# EAGLE design BMSv5 (EAGLE 7.2.0)

## Sheet 1 of 6
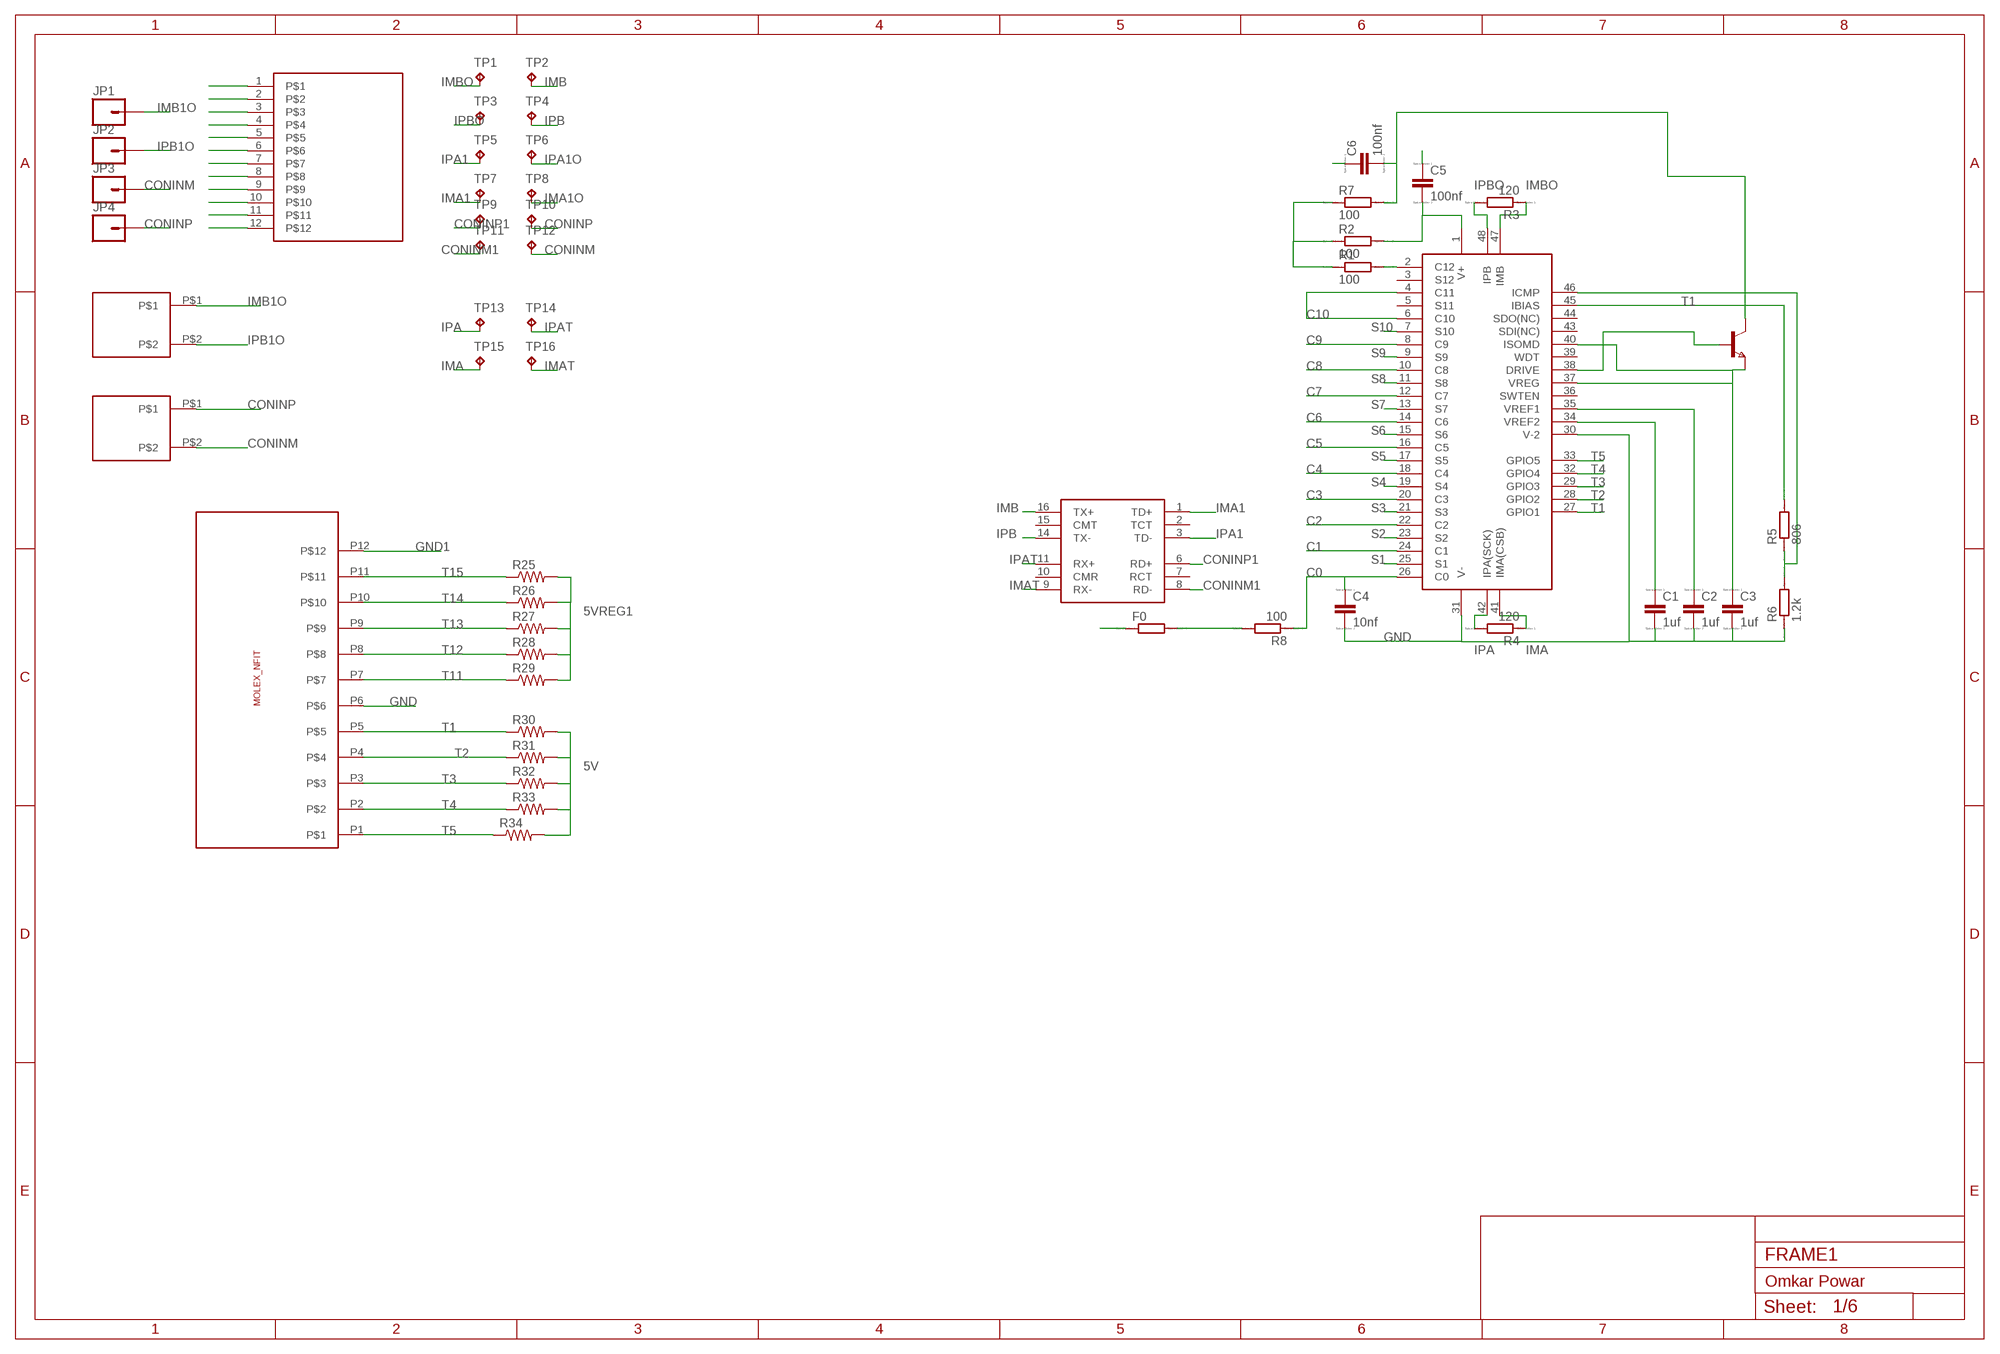
[diagram p0: schematic, sheet 1]

### Parts
C1  1uf  CC1206  [C1206]
C2  1uf  CC1206  [C1206]
C3  1uf  CC1206  [C1206]
C4  10nf  CC1206  [C1206]
C5  100nf  CC1206  [C1206]
C6  100nf  CC1206  [C1206]
F0  RR0603  [R0603]
JP1  M01PTH  [1X01]
JP2  M01PTH  [1X01]
JP3  M01PTH  [1X01]
JP4  M01PTH  [1X01]
R1  100  RR1206  [R1206]
R2  100  RR1206  [R1206]
R3  120  RR1206  [R1206]
R4  120  RR1206  [R1206]
R5  806  RR1206  [R1206]
R6  1.2k  RR1206  [R1206]
R7  100  RR1206  [R1206]
R8  100  RR1206  [R1206]
R25  R-US_R1206  [R1206]
R26  R-US_R1206  [R1206]
R27  R-US_R1206  [R1206]
R28  R-US_R1206  [R1206]
R29  R-US_R1206  [R1206]
R30  R-US_R1206  [R1206]
R31  R-US_R1206  [R1206]
R32  R-US_R1206  [R1206]
R33  R-US_R1206  [R1206]
R34  R-US_R1206  [R1206]
T1  NPNSOT223  [SOT223]
TP1  TPTP08SQ  [TP08SQ]
TP2  TPTP08SQ  [TP08SQ]
TP3  TPTP08SQ  [TP08SQ]
TP4  TPTP08SQ  [TP08SQ]
TP5  TPTP08SQ  [TP08SQ]
TP6  TPTP08SQ  [TP08SQ]
TP7  TPTP08SQ  [TP08SQ]
TP8  TPTP08SQ  [TP08SQ]
TP9  TPTP08SQ  [TP08SQ]
TP10  TPTP08SQ  [TP08SQ]
TP11  TPTP08SQ  [TP08SQ]
TP12  TPTP08SQ  [TP08SQ]
TP13  TPTP08SQ  [TP08SQ]
TP14  TPTP08SQ  [TP08SQ]
TP15  TPTP08SQ  [TP08SQ]
TP16  TPTP08SQ  [TP08SQ]
U$1  LTC6804  [SSOP-48_FW]
U$2  HX1188N  [HX1188]
U$3  TE12PIN  [TE12PIN]
U$4  MOLEX_2_PIN  [MOLEX_2PIN]
U$6  MOLEX_2_PIN  [MOLEX_2PIN]
U$8  MOLEX_12_PIN  [MOLEX_12PIN]

### Nets
5V: C3.1 R30.2 R31.2 R32.2 R33.2 R34.2 T1.3(E) U$1.37(VREG) U$1.40(ISOMD)
5VREG1: R25.2 R26.2 R27.2 R28.2 R29.2 ; also sheet 2
AFTFUSE: R1.1 R2.1 R7.1 ; also sheet 3
B1: U$3.2 ; also sheet 4
B2: U$3.3 ; also sheet 4
B3: U$3.4 ; also sheet 4
B4: U$3.5 ; also sheet 4
B5: U$3.6 ; also sheet 4
B6: U$3.7 ; also sheet 3
B7: U$3.8 ; also sheet 3
B8: U$3.9 ; also sheet 3
B9: U$3.10 ; also sheet 3
B10: U$3.11 ; also sheet 3
C0: C4.1 R8.1 U$1.26(C0)
C1: U$1.24(C1) ; also sheet 4
C2: U$1.22(C2) ; also sheet 4
C3: U$1.20(C3) ; also sheet 4
C4: U$1.18(C4) ; also sheet 4
C5: U$1.16(C5) ; also sheet 4
C6: U$1.14(C6) ; also sheet 3
C7: U$1.12(C7) ; also sheet 3
C8: U$1.10(C8) ; also sheet 3
C9: U$1.8(C9) ; also sheet 3
C10: U$1.4(C11) U$1.6(C10) ; also sheet 3
CELL0V: F0.1 U$3.1
CONINM: JP3.1 TP12.TP U$6.P$2
CONINM1: TP11.TP U$2.8(RD-)
CONINP: JP4.1 TP10.TP U$6.P$1
CONINP1: TP9.TP U$2.6(RD+)
GND: C1.2 C2.2 C3.2 C4.2 C5.1 C6.1 F0.2 R6.1 R8.2 U$1.30(V-2) U$1.31(V-) U$8.P6 ; also sheet 4
GND1: U$8.P12 ; also sheet 2,6
IMA: R4.1 TP15.TP U$1.41(IMA(CSB))
IMA1: TP7.TP U$2.1(TD+)
IMA1O: TP8.TP ; also sheet 2
IMAT: TP16.TP U$2.9(RX-)
IMB: TP2.TP U$2.16(TX+)
IMB1O: JP1.1 U$4.P$1 ; also sheet 2
IMBO: R3.1 TP1.TP U$1.47(IMB)
IPA: R4.2 TP13.TP U$1.42(IPA(SCK))
IPA1: TP5.TP U$2.3(TD-)
IPA1O: TP6.TP ; also sheet 2
IPAT: TP14.TP U$2.11(RX+)
IPB: TP4.TP U$2.14(TX-)
IPB1O: JP2.1 U$4.P$2 ; also sheet 2
IPBO: R3.2 TP3.TP U$1.48(IPB)
N$1: C6.2 R7.2 T1.2(C) T1.4(C)
N$11: C5.2 R2.2 U$1.1(V+)
N$12: T1.1(B) U$1.38(DRIVE)
N$16: C1.1 U$1.34(VREF2)
N$17: C2.1 U$1.35(VREF1)
N$19: R5.1 R6.2 U$1.46(ICMP)
N$21: R1.2 U$1.2(C12)
N$22: R5.2 U$1.45(IBIAS)
N$67: U$3.12
S1: U$1.25(S1)
S2: U$1.23(S2)
S3: U$1.21(S3)
S4: U$1.19(S4)
S5: U$1.17(S5)
S6: U$1.15(S6)
S7: U$1.13(S7)
S8: U$1.11(S8)
S9: U$1.9(S9)
S10: U$1.7(S10)
T1: R30.1 U$1.27(GPIO1) U$8.P5
T2: R31.1 U$1.28(GPIO2) U$8.P4
T3: R32.1 U$1.29(GPIO3) U$8.P3
T4: R33.1 U$1.32(GPIO4) U$8.P2
T5: R34.1 U$1.33(GPIO5) U$8.P1
T11: R29.1 U$8.P7 ; also sheet 2
T12: R28.1 U$8.P8 ; also sheet 2
T13: R27.1 U$8.P9 ; also sheet 2
T14: R26.1 U$8.P10 ; also sheet 2
T15: R25.1 U$8.P11 ; also sheet 2
Unconnected: U$1.3(S12) U$1.5(S11) U$1.36(SWTEN) U$1.39(WDT) U$1.43(SDI(NC)) U$1.44(SDO(NC)) U$2.2(TCT) U$2.7(RCT) U$2.10(CMR) U$2.15(CMT)

## Sheet 2 of 6
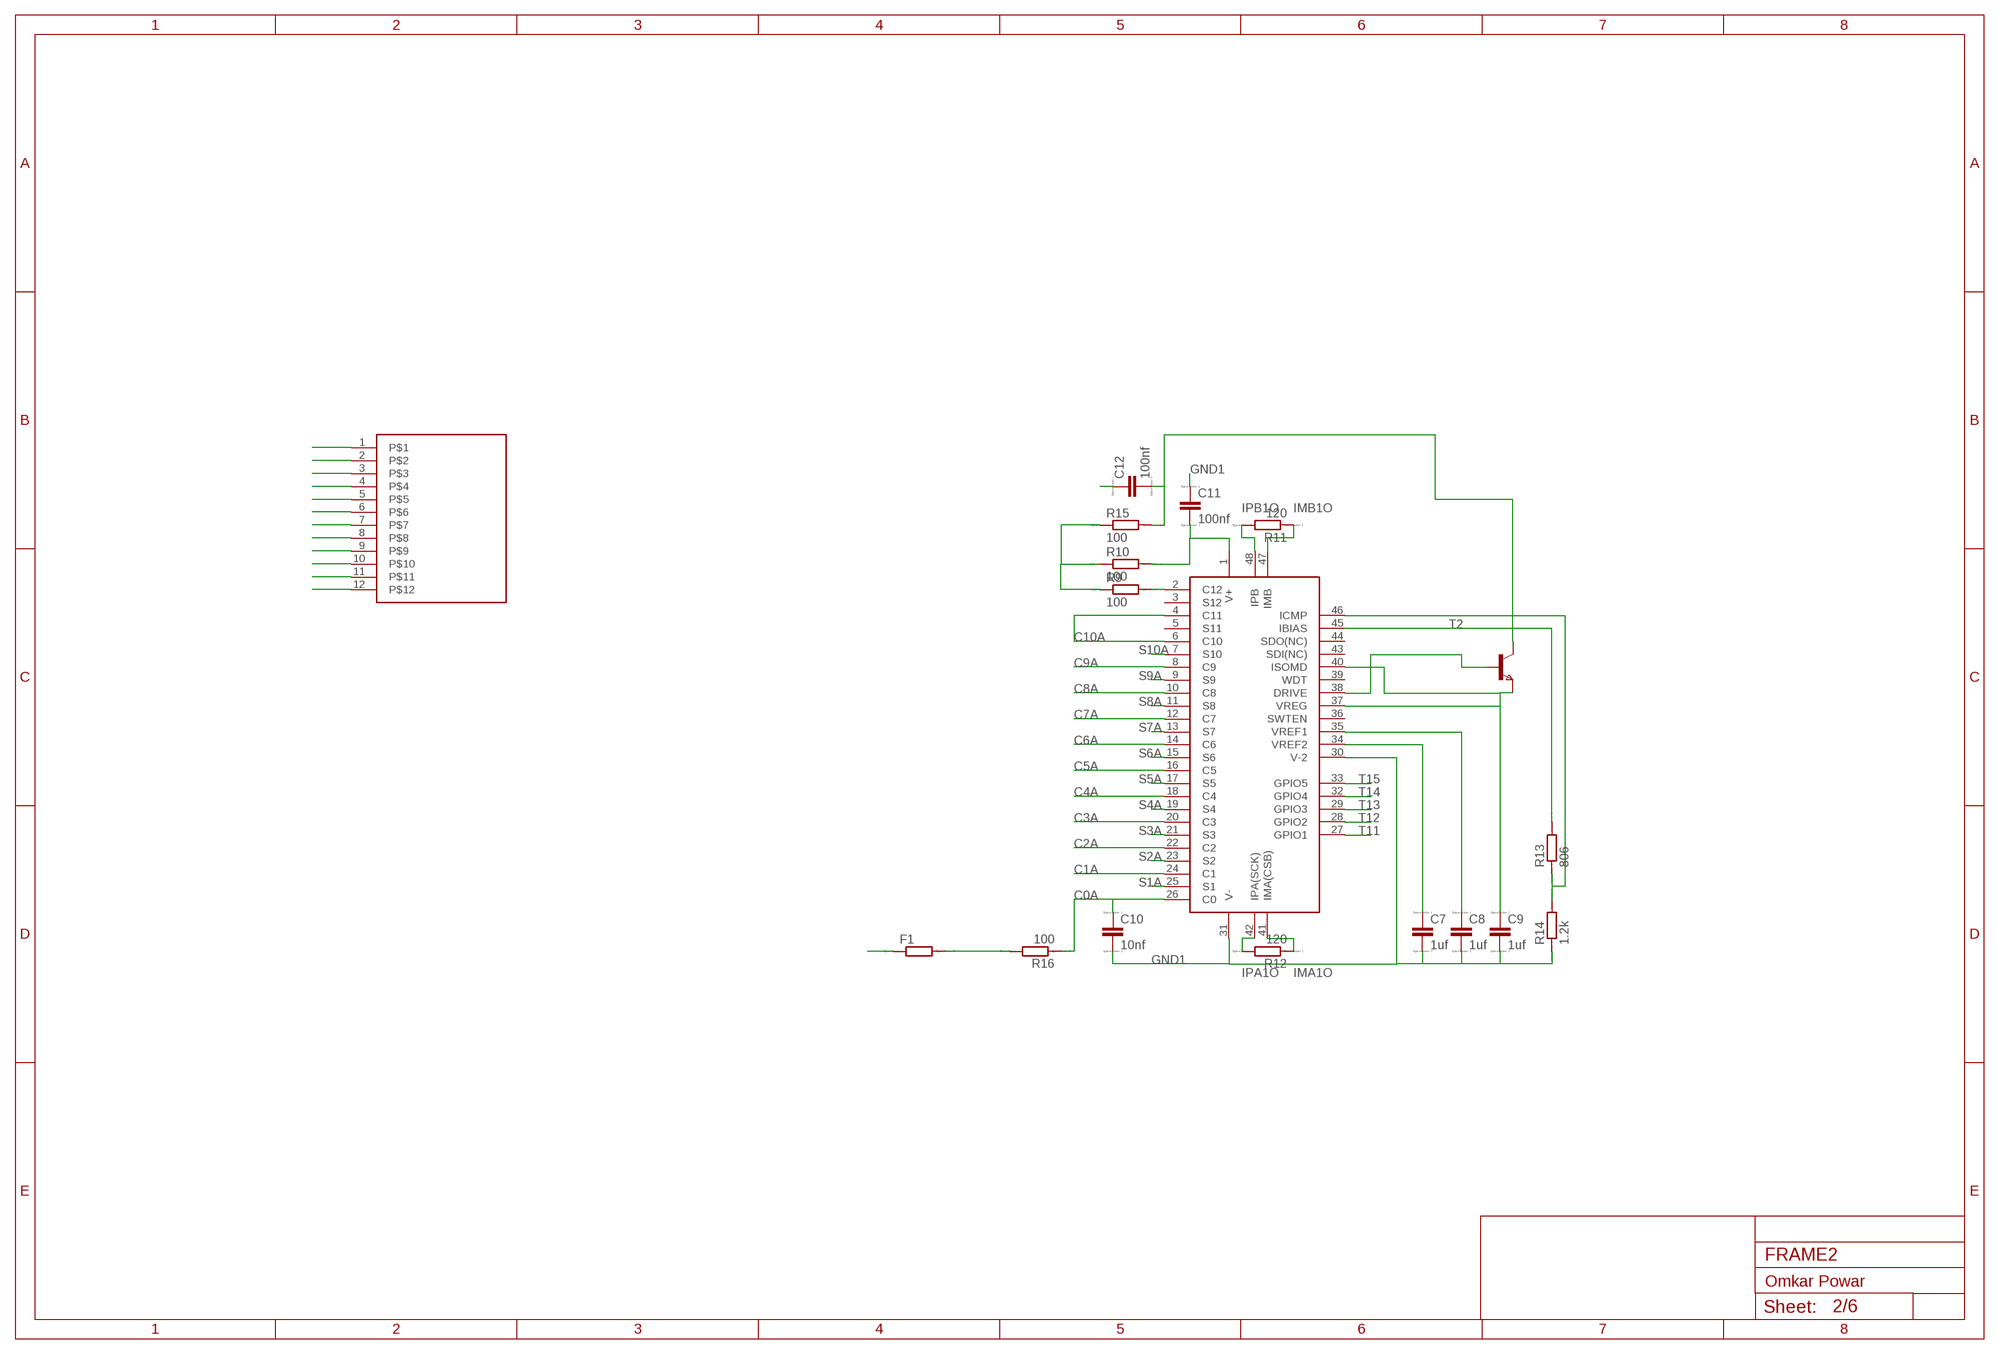
[diagram p1: schematic, sheet 2]

### Parts
C7  1uf  CC1206  [C1206]
C8  1uf  CC1206  [C1206]
C9  1uf  CC1206  [C1206]
C10  10nf  CC1206  [C1206]
C11  100nf  CC1206  [C1206]
C12  100nf  CC1206  [C1206]
F1  RR0603  [R0603]
R9  100  RR1206  [R1206]
R10  100  RR1206  [R1206]
R11  120  RR1206  [R1206]
R12  120  RR1206  [R1206]
R13  806  RR1206  [R1206]
R14  1.2k  RR1206  [R1206]
R15  100  RR1206  [R1206]
R16  100  RR1206  [R1206]
T2  NPNSOT223  [SOT223]
U$5  LTC6804  [SSOP-48_FW]
U$7  TE12PIN  [TE12PIN]

### Nets
5VREG1: C9.1 T2.3(E) U$5.37(VREG) U$5.40(ISOMD) ; also sheet 1
AFTFUSE1: R9.1 R10.1 R15.1 ; also sheet 5
B11: U$7.2 ; also sheet 6
B12: U$7.3 ; also sheet 6
B13: U$7.4 ; also sheet 6
B14: U$7.5 ; also sheet 6
B15: U$7.6 ; also sheet 6
B16: U$7.7 ; also sheet 5
B17: U$7.8 ; also sheet 5
B18: U$7.9 ; also sheet 5
B19: U$7.10 ; also sheet 5
B20: U$7.11 ; also sheet 5
C0A: C10.1 R16.1 U$5.26(C0)
C1A: U$5.24(C1) ; also sheet 6
C2A: U$5.22(C2) ; also sheet 6
C3A: U$5.20(C3) ; also sheet 6
C4A: U$5.18(C4) ; also sheet 6
C5A: U$5.16(C5) ; also sheet 6
C6A: U$5.14(C6) ; also sheet 5
C7A: U$5.12(C7) ; also sheet 5
C8A: U$5.10(C8) ; also sheet 5
C9A: U$5.8(C9) ; also sheet 5
C10A: U$5.4(C11) U$5.6(C10) ; also sheet 5
CELL0V1A: F1.1 U$7.1
GND1: C7.2 C8.2 C9.2 C10.2 C11.1 C12.1 F1.2 R14.1 R16.2 U$5.30(V-2) U$5.31(V-) ; also sheet 1,6
IMA1O: R12.1 U$5.41(IMA(CSB)) ; also sheet 1
IMB1O: R11.1 U$5.47(IMB) ; also sheet 1
IPA1O: R12.2 U$5.42(IPA(SCK)) ; also sheet 1
IPB1O: R11.2 U$5.48(IPB) ; also sheet 1
N$15: R9.2 U$5.2(C12)
N$20: C11.2 R10.2 U$5.1(V+)
N$23: C7.1 U$5.34(VREF2)
N$25: C8.1 U$5.35(VREF1)
N$36: R13.1 R14.2 U$5.46(ICMP)
N$49: R13.2 U$5.45(IBIAS)
N$63: C12.2 R15.2 T2.2(C) T2.4(C)
N$68: T2.1(B) U$5.38(DRIVE)
N$74: U$7.12
S1A: U$5.25(S1)
S2A: U$5.23(S2)
S3A: U$5.21(S3)
S4A: U$5.19(S4)
S5A: U$5.17(S5)
S6A: U$5.15(S6)
S7A: U$5.13(S7)
S8A: U$5.11(S8)
S9A: U$5.9(S9)
S10A: U$5.7(S10)
T11: U$5.27(GPIO1) ; also sheet 1
T12: U$5.28(GPIO2) ; also sheet 1
T13: U$5.29(GPIO3) ; also sheet 1
T14: U$5.32(GPIO4) ; also sheet 1
T15: U$5.33(GPIO5) ; also sheet 1
Unconnected: U$5.3(S12) U$5.5(S11) U$5.36(SWTEN) U$5.39(WDT) U$5.43(SDI(NC)) U$5.44(SDO(NC))

## Sheet 3 of 6
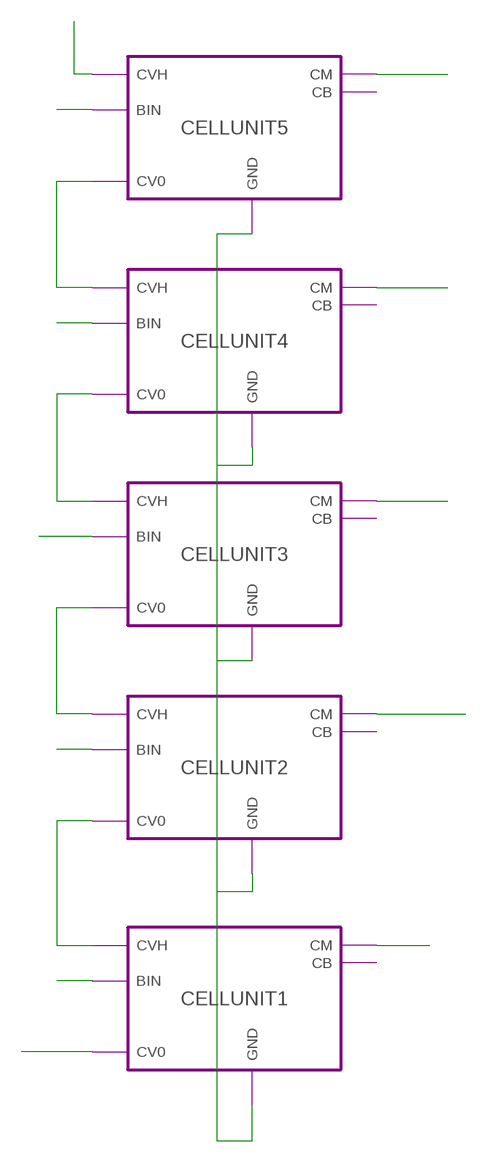
[diagram p2: schematic, sheet 3]

### Module instances
CELLUNIT1 = CELLUNIT$A
CELLUNIT2 = CELLUNIT$A
CELLUNIT3 = CELLUNIT$A
CELLUNIT4 = CELLUNIT$A
CELLUNIT5 = CELLUNIT$A

### Nets
AFTFUSE: port CELLUNIT5.CVH ; also sheet 1
B6: port CELLUNIT1.BIN ; also sheet 1
B7: port CELLUNIT2.BIN ; also sheet 1
B8: port CELLUNIT3.BIN ; also sheet 1
B9: port CELLUNIT4.BIN ; also sheet 1
B10: port CELLUNIT5.BIN ; also sheet 1
C6: port CELLUNIT1.CM ; also sheet 1
C7: port CELLUNIT2.CM ; also sheet 1
C8: port CELLUNIT3.CM ; also sheet 1
C9: port CELLUNIT4.CM ; also sheet 1
C10: port CELLUNIT5.CM ; also sheet 1
CI5: port CELLUNIT1.CV0 ; also sheet 4
N$2: port CELLUNIT3.GND CELLUNIT1.GND CELLUNIT2.GND CELLUNIT5.GND CELLUNIT4.GND
N$3: port CELLUNIT2.CV0 CELLUNIT1.CVH
N$64: port CELLUNIT2.CVH CELLUNIT3.CV0
N$65: port CELLUNIT4.CVH CELLUNIT5.CV0
N$66: port CELLUNIT4.CV0 CELLUNIT3.CVH

## Sheet 4 of 6
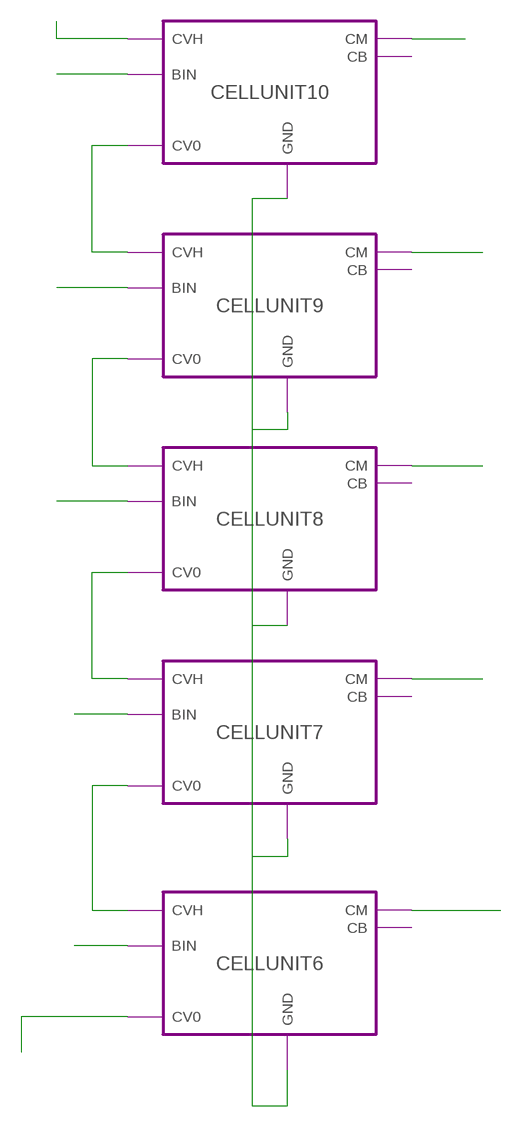
[diagram p3: schematic, sheet 4]

### Module instances
CELLUNIT6 = CELLUNIT$B
CELLUNIT7 = CELLUNIT$B
CELLUNIT8 = CELLUNIT$B
CELLUNIT9 = CELLUNIT$B
CELLUNIT10 = CELLUNIT$B

### Nets
B1: port CELLUNIT6.BIN ; also sheet 1
B2: port CELLUNIT7.BIN ; also sheet 1
B3: port CELLUNIT8.BIN ; also sheet 1
B4: port CELLUNIT9.BIN ; also sheet 1
B5: port CELLUNIT10.BIN ; also sheet 1
C1: port CELLUNIT6.CM ; also sheet 1
C2: port CELLUNIT7.CM ; also sheet 1
C3: port CELLUNIT8.CM ; also sheet 1
C4: port CELLUNIT9.CM ; also sheet 1
C5: port CELLUNIT10.CM ; also sheet 1
CI5: port CELLUNIT10.CVH ; also sheet 3
GND: port CELLUNIT6.CV0 ; also sheet 1
N$69: port CELLUNIT8.GND CELLUNIT6.GND CELLUNIT7.GND CELLUNIT10.GND CELLUNIT9.GND
N$70: port CELLUNIT7.CV0 CELLUNIT6.CVH
N$71: port CELLUNIT7.CVH CELLUNIT8.CV0
N$72: port CELLUNIT9.CVH CELLUNIT10.CV0
N$73: port CELLUNIT9.CV0 CELLUNIT8.CVH

## Sheet 5 of 6
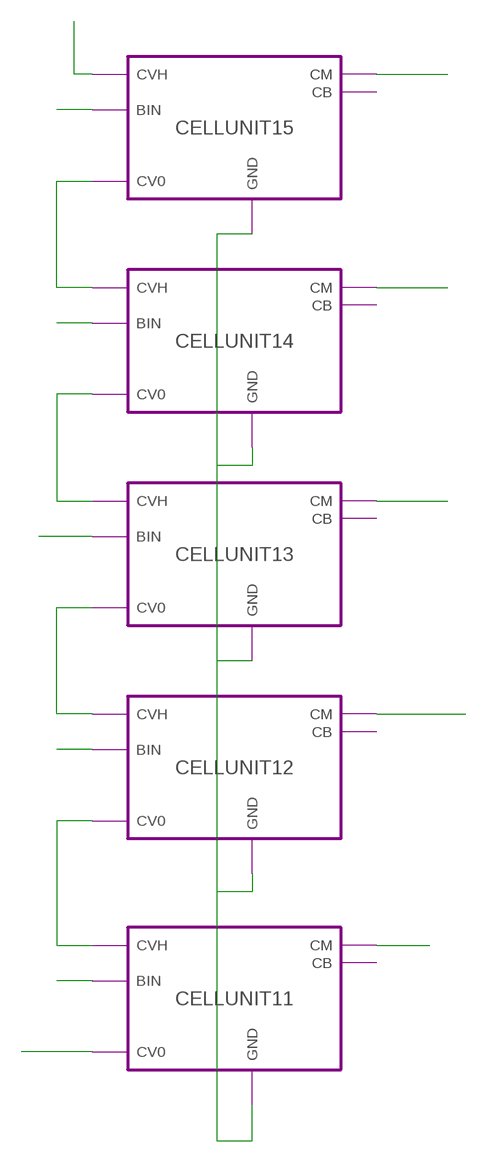
[diagram p4: schematic, sheet 5]

### Module instances
CELLUNIT11 = CELLUNIT$A
CELLUNIT12 = CELLUNIT$A
CELLUNIT13 = CELLUNIT$A
CELLUNIT14 = CELLUNIT$A
CELLUNIT15 = CELLUNIT$A

### Nets
AFTFUSE1: port CELLUNIT15.CVH ; also sheet 2
B16: port CELLUNIT11.BIN ; also sheet 2
B17: port CELLUNIT12.BIN ; also sheet 2
B18: port CELLUNIT13.BIN ; also sheet 2
B19: port CELLUNIT14.BIN ; also sheet 2
B20: port CELLUNIT15.BIN ; also sheet 2
C6A: port CELLUNIT11.CM ; also sheet 2
C7A: port CELLUNIT12.CM ; also sheet 2
C8A: port CELLUNIT13.CM ; also sheet 2
C9A: port CELLUNIT14.CM ; also sheet 2
C10A: port CELLUNIT15.CM ; also sheet 2
CI1: port CELLUNIT11.CV0 ; also sheet 6
N$75: port CELLUNIT13.GND CELLUNIT11.GND CELLUNIT12.GND CELLUNIT15.GND CELLUNIT14.GND
N$76: port CELLUNIT12.CV0 CELLUNIT11.CVH
N$77: port CELLUNIT12.CVH CELLUNIT13.CV0
N$78: port CELLUNIT14.CVH CELLUNIT15.CV0
N$79: port CELLUNIT14.CV0 CELLUNIT13.CVH

## Sheet 6 of 6
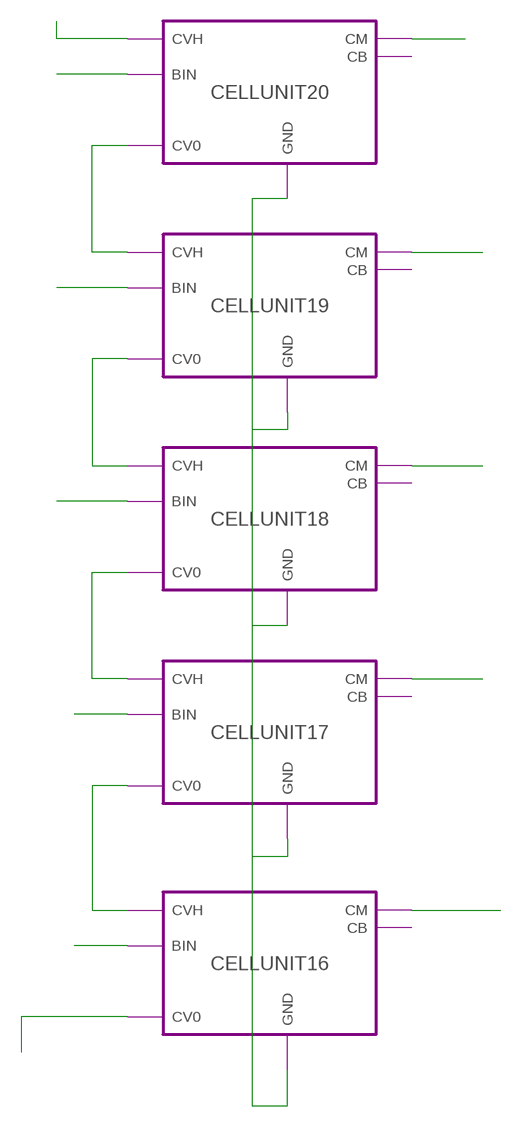
[diagram p5: schematic, sheet 6]

### Module instances
CELLUNIT16 = CELLUNIT$B
CELLUNIT17 = CELLUNIT$B
CELLUNIT18 = CELLUNIT$B
CELLUNIT19 = CELLUNIT$B
CELLUNIT20 = CELLUNIT$B

### Nets
B11: port CELLUNIT16.BIN ; also sheet 2
B12: port CELLUNIT17.BIN ; also sheet 2
B13: port CELLUNIT18.BIN ; also sheet 2
B14: port CELLUNIT19.BIN ; also sheet 2
B15: port CELLUNIT20.BIN ; also sheet 2
C1A: port CELLUNIT16.CM ; also sheet 2
C2A: port CELLUNIT17.CM ; also sheet 2
C3A: port CELLUNIT18.CM ; also sheet 2
C4A: port CELLUNIT19.CM ; also sheet 2
C5A: port CELLUNIT20.CM ; also sheet 2
CI1: port CELLUNIT20.CVH ; also sheet 5
GND1: port CELLUNIT16.CV0 ; also sheet 1,2
N$80: port CELLUNIT18.GND CELLUNIT16.GND CELLUNIT17.GND CELLUNIT20.GND CELLUNIT19.GND
N$81: port CELLUNIT17.CV0 CELLUNIT16.CVH
N$82: port CELLUNIT17.CVH CELLUNIT18.CV0
N$83: port CELLUNIT19.CVH CELLUNIT20.CV0
N$84: port CELLUNIT19.CV0 CELLUNIT18.CVH

## Library data of the parts
C1-C12 = eagle-ltspice:C: CAPACITOR, European symbol; SPICEMODEL: NONE; SPICEPREFIX: C
F0 F1 R1-R16 = eagle-ltspice:R: RESISTOR, European symbol; SPICEMODEL: NONE; SPICEPREFIX: R
JP1-JP4 = SparkFun-Connectors:M01: Header 1 Standard 1-pin 0.1" header. Use with straight break away headers (SKU : PRT-00116), right angle break away headers (PRT-00553), swiss pins (PRT-00743), machine pins (PRT-00117), and female headers (PRT-00115).
R25-R34 = adafruit:R-US_: RESISTOR, American symbol
T1 T2 = zetex:NPNSOT223: NPN TRANSISTOR; MPN: DJT4031N-13; OC_FARNELL: 1710672; OC_NEWARK: 25R4490
TP1-TP16 = testpad:TP: Test pad
U$1 U$5 = LTC6804:LTC6804
U$2 = HX1188NL:HX1188N
U$3 U$7 = te12pin:TE12PIN
U$4 U$6 = Molex_NanoFit:MOLEX_2_PIN
U$8 = Molex_NanoFit:MOLEX_12_PIN

## Module CELLUNIT
Ports: CVH(io) CV0(io) CM(io) CB(io) GND(io) AFTFUSE(io)

### Library data of the parts

## Module CELLUNIT$A
Ports: CVH(io) CV0(io) CM(io) CB(io) GND(io) BIN(io)
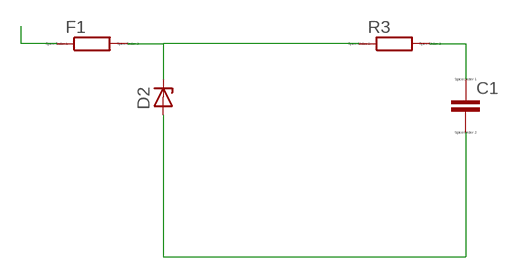
[diagram p6: schematic, module CELLUNIT$A, sheet 1]

### Parts
C1  CC1206  [C1206]
D2  ZENER-DIODESOD80C  [SOD80C]
F1  RR0603  [R0603]
R3  RR1206  [R1206]

### Nets
BIN: F1.1
CM: C1.1 R3.2
CV0: C1.2 D2.A
CVH: D2.C F1.2 R3.1

### Library data of the parts
C1 = eagle-ltspice:C: CAPACITOR, European symbol; SPICEMODEL: NONE; SPICEPREFIX: C
D2 = diode:ZENER-DIODE: Z-Diode
F1 R3 = eagle-ltspice:R: RESISTOR, European symbol; SPICEMODEL: NONE; SPICEPREFIX: R

## Module CELLUNIT$B
Ports: CVH(io) CV0(io) CM(io) CB(io) GND(io) BIN(io)
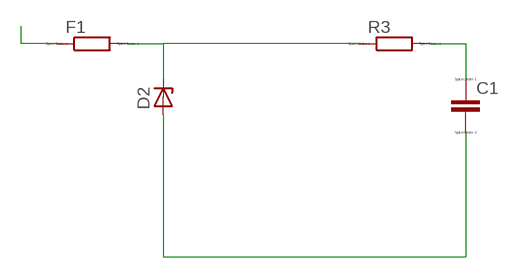
[diagram p7: schematic, module CELLUNIT$B, sheet 1]

### Parts
C1  CC1206  [C1206]
D2  ZENER-DIODESOD80C  [SOD80C]
F1  RR0603  [R0603]
R3  RR1206  [R1206]

### Nets
BIN: F1.1
CM: C1.1 R3.2
CV0: C1.2 D2.A
CVH: D2.C F1.2 R3.1

### Library data of the parts
C1 = eagle-ltspice:C: CAPACITOR, European symbol; SPICEMODEL: NONE; SPICEPREFIX: C
D2 = diode:ZENER-DIODE: Z-Diode
F1 R3 = eagle-ltspice:R: RESISTOR, European symbol; SPICEMODEL: NONE; SPICEPREFIX: R

## Board
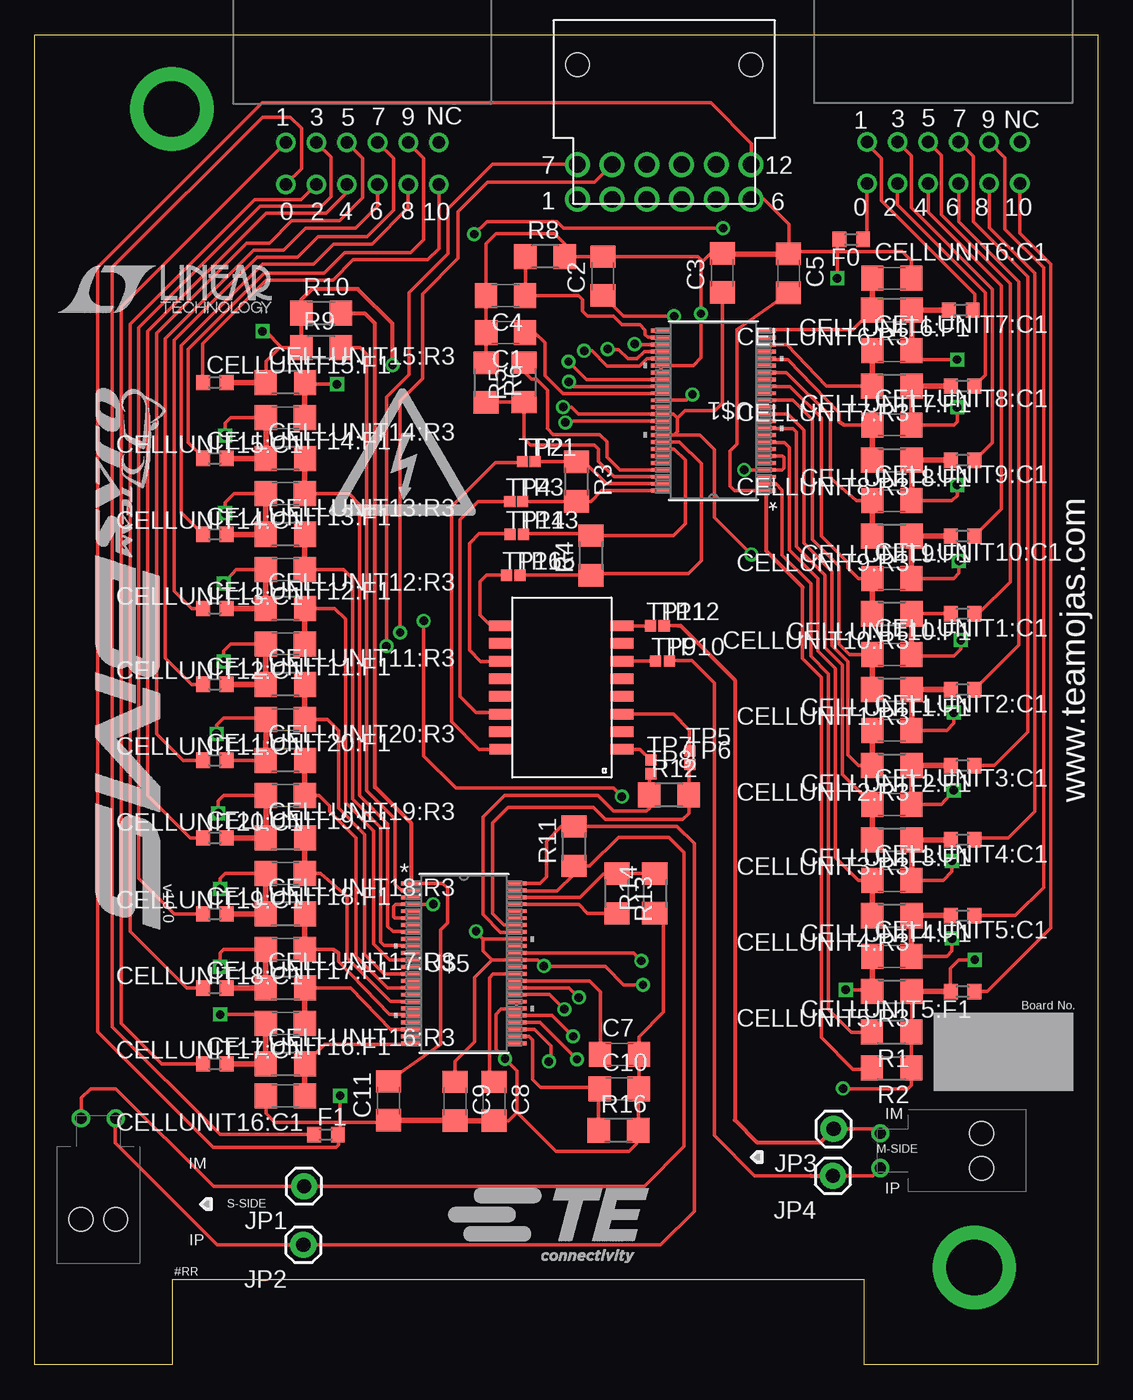
[diagram p8: board, top side]
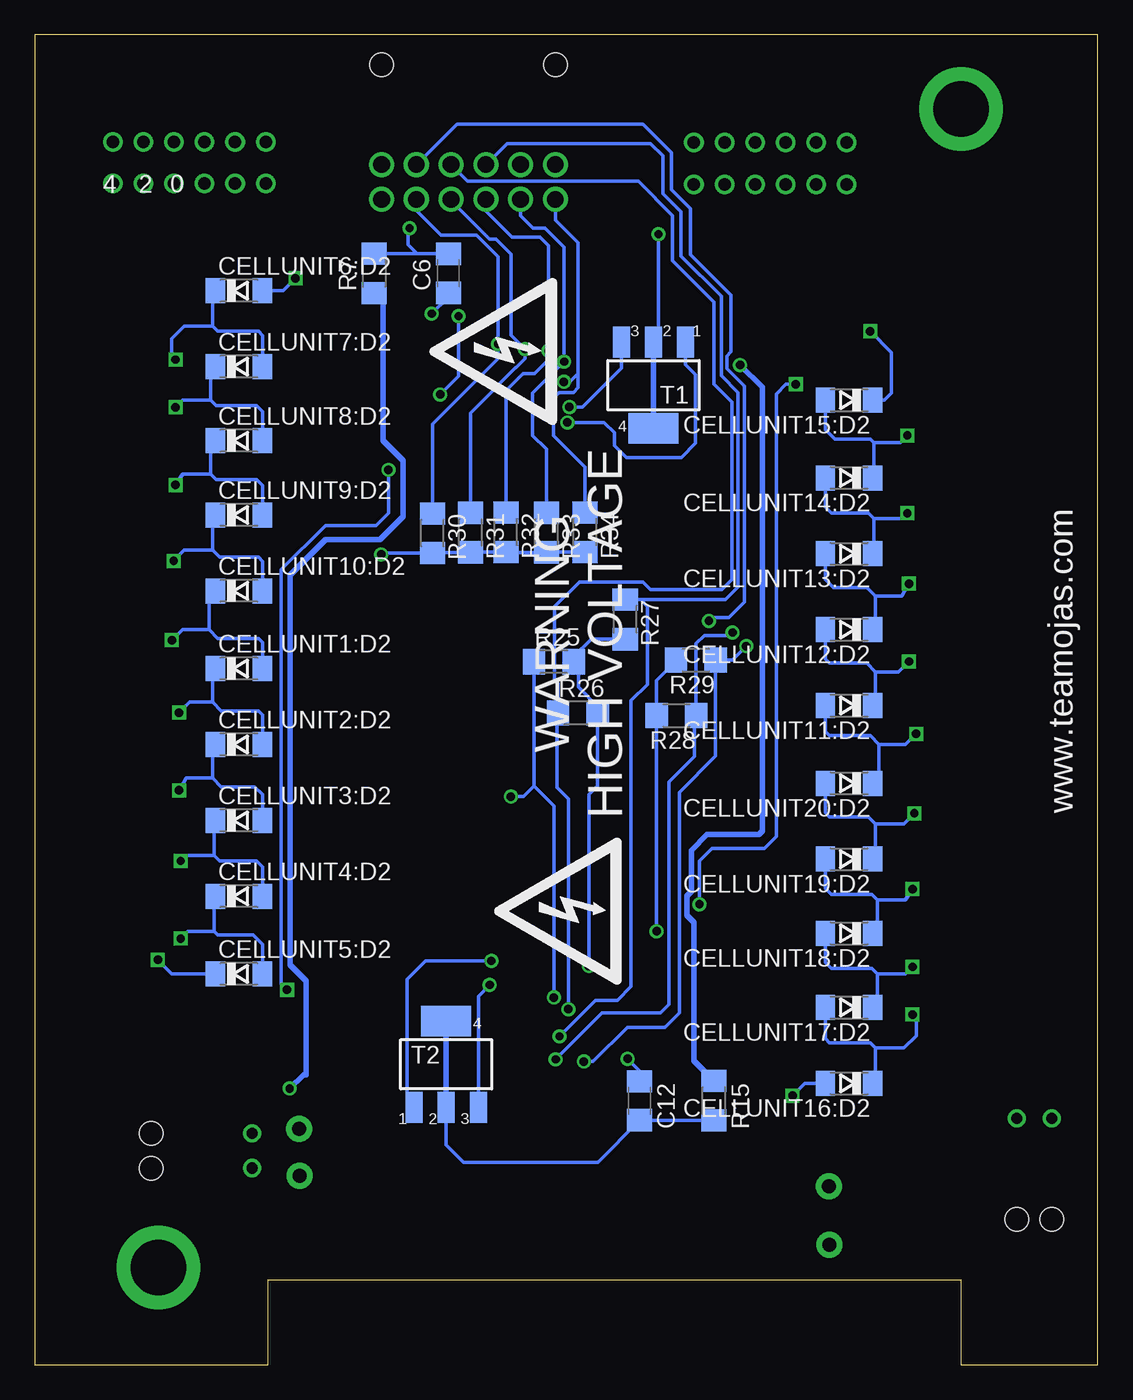
[diagram p9: board, bottom side, seen from below]

Size 76.49 x 95.68 mm. Coordinates in mm from the lower left corner, seen from the top.
Outline: 0,95.68 76.49,95.68 76.49,0 59.7,0 59.7,6.1 9.88,6.1 9.88,0 0,0 0,95.68
Copper layers (1*16): Top 0.035mm / dielectric 1.5mm / Bottom 0.035mm
Design rules "default": minimum track width 10mil, minimum drill 24mil, track to track 8mil, track to pad 8mil, pad to pad 8mil, via to via 8mil, smd to smd 8mil, copper to edge 40mil, drill to drill 8mil, minimum pad ring 10mil, minimum via ring 8mil, stop-mask expansion 4mil, vias tented up to drill 0mil, thermal gap 10mil

### Footprints (pad centres in the part's own frame; a part is rotated, then mirrored left to right if it is on the bottom)
C1206 = smd 1.6 x 1.8: 1 -1.4,0; 2 1.4,0
SOD80C = smd 1.4 x 1.8: A 1.7,0; C -1.7,0
R0603 = smd 1 x 1.1: 1 -0.85,0; 2 0.85,0
R1206 = smd 1.6 x 1.803: 1 -1.422,0; 2 1.422,0
1X01 = drill 1.016 pad 1.88: 1 0,0
SOT223 = smd 1.219 x 2.235: 1 -2.311,-3.099; 2 0,-3.099; 3 2.311,-3.099 | smd 3.6 x 2.2: 4 0,3.099
TP08SQ = smd 0.8 x 0.8: TP 0,0
SSOP-48_FW = smd 1.448 x 0.279: 1 -3.785,5.754; 2 -3.785,5.254; 3 -3.785,4.754; 4 -3.785,4.253; 5 -3.785,3.753; 6 -3.785,3.252; 7 -3.785,2.752; 8 -3.785,2.252; 9 -3.785,1.751; 10 -3.785,1.251; 11 -3.785,0.751; 12 -3.785,0.25; 13 -3.785,-0.25; 14 -3.785,-0.751; 15 -3.785,-1.251; 16 -3.785,-1.751; 17 -3.785,-2.252; 18 -3.785,-2.752; 19 -3.785,-3.252; 20 -3.785,-3.753; 21 -3.785,-4.253; 22 -3.785,-4.754; 23 -3.785,-5.254; 24 -3.785,-5.754; 25 3.785,-5.754; 26 3.785,-5.254; 27 3.785,-4.754; 28 3.785,-4.253; 29 3.785,-3.753; 30 3.785,-3.252; 31 3.785,-2.752; 32 3.785,-2.252; 33 3.785,-1.751; 34 3.785,-1.251; 35 3.785,-0.751; 36 3.785,-0.25; 37 3.785,0.25; 38 3.785,0.751; 39 3.785,1.251; 40 3.785,1.751; 41 3.785,2.252; 42 3.785,2.752; 43 3.785,3.252; 44 3.785,3.753; 45 3.785,4.253; 46 3.785,4.754; 47 3.785,5.254; 48 3.785,5.754
HX1188 = smd 1.651 x 0.762: 1 -4.318,4.318; 2 -4.318,3.048; 3 -4.318,1.778; 4 -4.318,0.508; 5 -4.318,-0.762; 6 -4.318,-2.032; 7 -4.318,-3.302; 8 -4.318,-4.572; 9 4.402,-4.572; 10 4.402,-3.302; 11 4.402,-2.032; 12 4.402,-0.762; 13 4.402,0.508; 14 4.402,1.778; 15 4.402,3.048; 16 4.372,4.318
TE12PIN = drill 0.9: 1 -4.4,-3; 2 -4.4,0; 3 -2.2,-3; 4 -2.2,0; 5 0,-3; 6 0,0; 7 2.2,-3; 8 2.2,0; 9 4.4,-3; 10 4.4,0; 11 6.6,-3; 12 6.6,0
MOLEX_2PIN = drill 0.8 pad 1.2: P$1 1.72,10.48; P$2 4.22,10.48 | hole 1.7: 1.72,3.2; 4.22,3.2
MOLEX_12PIN = drill 1.2: P1 6.25,9.68; P2 3.75,9.68; P3 1.25,9.68; P4 -1.25,9.68; P5 -3.75,9.68; P6 -6.25,9.68; P7 6.25,7.18; P8 3.75,7.18; P9 1.25,7.18; P10 -1.25,7.18; P11 -3.75,7.18; P12 -6.25,7.18 | hole 1.7: -6.25,0; 6.25,0

### Placement (x,y rotation side)
C1  33.88,74.26 180 top
C2  40.87,78.33 90 top
C3  49.46,78.55 90 top
C4  33.87,76.9 180 top
C5  54.24,78.52 270 top
C6  46.73,78.52 90 bottom
C7  42.07,22.33 0 top
C8  33.05,18.96 270 top
C9  30.24,18.96 270 top
C10  42.05,19.85 0 top
C11  25.47,19 90 top
C12  32.97,18.99 270 bottom
CELLUNIT1:C1  [C1206]  61.67,51.1 0 top
CELLUNIT1:D2  [SOD80C]  61.8,50.09 0 bottom
CELLUNIT1:F1  [R0603]  66.75,48.56 180 top
CELLUNIT1:R3  [R1206]  61.67,48.56 180 top
CELLUNIT2:C1  [C1206]  61.67,45.64 0 top
CELLUNIT2:D2  [SOD80C]  61.8,44.63 0 bottom
CELLUNIT2:F1  [R0603]  66.75,43.1 180 top
CELLUNIT2:R3  [R1206]  61.67,43.1 180 top
CELLUNIT3:C1  [C1206]  61.67,40.31 0 top
CELLUNIT3:D2  [SOD80C]  61.8,39.17 0 bottom
CELLUNIT3:F1  [R0603]  66.75,37.77 180 top
CELLUNIT3:R3  [R1206]  61.67,37.77 180 top
CELLUNIT4:C1  [C1206]  61.67,34.85 0 top
CELLUNIT4:D2  [SOD80C]  61.8,33.71 0 bottom
CELLUNIT4:F1  [R0603]  66.75,32.31 180 top
CELLUNIT4:R3  [R1206]  61.67,32.31 180 top
CELLUNIT5:C1  [C1206]  61.67,29.39 0 top
CELLUNIT5:D2  [SOD80C]  61.8,28.12 0 bottom
CELLUNIT5:F1  [R0603]  66.75,26.85 180 top
CELLUNIT5:R3  [R1206]  61.67,26.85 180 top
CELLUNIT6:C1  [C1206]  61.67,78.16 0 top
CELLUNIT6:D2  [SOD80C]  61.8,77.27 0 bottom
CELLUNIT6:F1  [R0603]  66.63,75.87 180 top
CELLUNIT6:R3  [R1206]  61.67,75.87 180 top
CELLUNIT7:C1  [C1206]  61.67,72.95 0 top
CELLUNIT7:D2  [SOD80C]  61.8,71.81 0 bottom
CELLUNIT7:F1  [R0603]  66.75,70.41 180 top
CELLUNIT7:R3  [R1206]  61.67,70.41 180 top
CELLUNIT8:C1  [C1206]  61.67,67.61 0 top
CELLUNIT8:D2  [SOD80C]  61.8,66.47 0 bottom
CELLUNIT8:F1  [R0603]  66.75,65.08 180 top
CELLUNIT8:R3  [R1206]  61.67,65.08 180 top
CELLUNIT9:C1  [C1206]  61.67,62.15 0 top
CELLUNIT9:D2  [SOD80C]  61.8,61.14 0 bottom
CELLUNIT9:F1  [R0603]  66.75,59.61 180 top
CELLUNIT9:R3  [R1206]  61.67,59.61 180 top
CELLUNIT10:C1  [C1206]  61.67,56.57 0 top
CELLUNIT10:D2  [SOD80C]  61.8,55.68 0 bottom
CELLUNIT10:F1  [R0603]  66.75,54.03 180 top
CELLUNIT10:R3  [R1206]  61.67,54.03 180 top
CELLUNIT11:C1  [C1206]  18.03,46.41 180 top
CELLUNIT11:D2  [SOD80C]  17.91,47.42 180 bottom
CELLUNIT11:F1  [R0603]  12.95,48.95 0 top
CELLUNIT11:R3  [R1206]  18.03,48.95 0 top
CELLUNIT12:C1  [C1206]  18.03,51.87 180 top
CELLUNIT12:D2  [SOD80C]  17.91,52.88 180 bottom
CELLUNIT12:F1  [R0603]  12.95,54.41 0 top
CELLUNIT12:R3  [R1206]  18.03,54.41 0 top
CELLUNIT13:C1  [C1206]  18.03,57.2 180 top
CELLUNIT13:D2  [SOD80C]  17.91,58.34 180 bottom
CELLUNIT13:F1  [R0603]  12.95,59.74 0 top
CELLUNIT13:R3  [R1206]  18.03,59.74 0 top
CELLUNIT14:C1  [C1206]  18.03,62.66 180 top
CELLUNIT14:D2  [SOD80C]  17.91,63.8 180 bottom
CELLUNIT14:F1  [R0603]  12.95,65.2 0 top
CELLUNIT14:R3  [R1206]  18.03,65.2 0 top
CELLUNIT15:C1  [C1206]  18.03,68.12 180 top
CELLUNIT15:D2  [SOD80C]  17.91,69.39 180 bottom
CELLUNIT15:F1  [R0603]  12.95,70.66 0 top
CELLUNIT15:R3  [R1206]  18.03,70.66 0 top
CELLUNIT16:C1  [C1206]  18.03,19.36 180 top
CELLUNIT16:D2  [SOD80C]  17.91,20.24 180 bottom
CELLUNIT16:F1  [R0603]  12.95,21.64 0 top
CELLUNIT16:R3  [R1206]  18.03,21.64 0 top
CELLUNIT17:C1  [C1206]  18.03,24.56 180 top
CELLUNIT17:D2  [SOD80C]  17.91,25.71 180 bottom
CELLUNIT17:F1  [R0603]  12.95,27.1 0 top
CELLUNIT17:R3  [R1206]  18.03,27.1 0 top
CELLUNIT18:C1  [C1206]  18.03,29.9 180 top
CELLUNIT18:D2  [SOD80C]  17.91,31.04 180 bottom
CELLUNIT18:F1  [R0603]  12.95,32.44 0 top
CELLUNIT18:R3  [R1206]  18.03,32.44 0 top
CELLUNIT19:C1  [C1206]  18.03,35.36 180 top
CELLUNIT19:D2  [SOD80C]  17.91,36.37 180 bottom
CELLUNIT19:F1  [R0603]  12.95,37.9 0 top
CELLUNIT19:R3  [R1206]  18.03,37.9 0 top
CELLUNIT20:C1  [C1206]  18.03,40.95 180 top
CELLUNIT20:D2  [SOD80C]  17.91,41.83 180 bottom
CELLUNIT20:F1  [R0603]  12.95,43.48 0 top
CELLUNIT20:R3  [R1206]  18.03,43.48 0 top
F0  58.75,80.95 180 top
F1  20.96,16.56 0 top
JP1  19.37,12.85 180 top
JP2  19.33,8.62 180 top
JP3  57.48,16.96 180 top
JP4  57.42,13.59 180 top
R1  61.65,23.95 180 top
R2  61.65,21.35 180 top
R3  38.99,63.54 270 top
R4  40.01,58.22 90 top
R5  35.2,70.67 90 top
R6  32.48,70.66 270 top
R7  52.08,78.52 90 bottom
R8  36.72,79.73 0 top
R9  20.6,73.18 0 top
R10  20.6,75.65 0 top
R11  38.79,37.3 90 top
R12  45.63,40.99 0 top
R13  41.89,33.9 270 top
R14  44.61,33.91 90 top
R15  27.62,19 270 bottom
R16  42,16.86 0 top
R25  39.14,50.57 0 bottom
R26  37.41,46.89 0 bottom
R27  34.01,53.62 270 bottom
R28  30.33,46.71 180 bottom
R29  28.93,50.7 180 bottom
R30  47.88,59.82 270 bottom
R31  45.14,59.87 270 bottom
R32  42.6,59.89 270 bottom
R33  39.67,59.87 270 bottom
R34  36.91,59.89 270 bottom
T1  31.98,70.46 180 bottom
T2  46.89,21.61 0 bottom
TP1  35.99,64.97 0 top
TP2  35.09,64.98 0 top
TP3  35.1,62.1 0 top
TP4  34.18,62.09 0 top
TP5  47.14,44.15 0 top
TP6  47.14,43.18 0 top
TP7  44.32,43.51 0 top
TP8  44.32,42.52 0 top
TP9  44.65,50.62 0 top
TP10  45.67,50.62 0 top
TP11  44.3,53.16 0 top
TP12  45.29,53.16 0 top
TP13  35.15,59.74 0 top
TP14  34.19,59.74 0 top
TP15  34.92,56.79 0 top
TP16  33.93,56.79 0 top
U$1  48.83,68.63 180 top
U$2  37.93,48.59 180 top
U$3  64.27,87.98 0 top
U$4  1.61,7.25 0 top
U$5  30.88,28.88 0 top
U$6  71.32,12.43 90 top
U$7  22.47,87.93 0 top
U$8  45.29,93.52 180 top

### Tracks (layer width: path | path; a pad name or v marks a point on that pad's centre or on a via)
5V  (via drill 0.6)
  Top 0.254: U$1.40 46,66.88 | 46,66.88 46.25,67.13 46.25,68.1 | 46.25,68.1 45.95,68.4 45.06,68.4 U$1.37 39.14,68.38 38.61,68.91 v38.02,68.91 | C3.1 49.46,69.17 48.92,68.63 46.79,68.63 46.25,68.1 | 46,66.88 47.85,66.88 48.89,65.84 48.89,60.96 v51.56,58.29
  Bottom 0.254: T1.3 34.29,71.7 37.08,68.91 v38.02,68.91 | T1.3 | R34.2 39.65,58.47 R33.2 42.57,58.45 R32.2 45.11,58.47 R31.2 47.83,58.45 R30.2 51.46,58.39 v51.56,58.29
5VREG1  (via drill 0.6)
  Top 0.254: v43.76,27.33 42.37,27.33 41.05,28.65 36.65,28.65 v36.63,28.68 36.17,29.13 U$5.37 32.9,29.13 | v31.75,31.19 31.75,31.14 32.26,30.63 | 32.26,30.63 U$5.40 | 32.9,29.13 32.26,29.77 32.26,30.63 | C9.1 30.24,21.84 31.65,23.24 31.65,27.88 32.9,29.13
  Bottom 0.254: 35.81,46.71 R26.2 | v36.63,28.68 36.63,41.02 35.99,41.66 R26.2 | R26.2 35.99,47.37 37.36,48.74 37.36,50.22 R25.2 37.72,50.95 36.45,52.22 34.04,52.22 R27.2 | R29.2 30.35,50.62 31.75,49.22 R28.2 | R28.2 | R28.2 v31.75,31.19 | T2.3 44.58,26.52 v43.76,27.33
AFTFUSE  (via drill 0.6)
  Top 0.254: v67.64,29.13 66.5,29.13 65.86,28.5 65.86,26.89 CELLUNIT5:F1.2 | CELLUNIT5:R3.1 63.09,24.56 R1.1 R2.1 63.07,20.12 62.81,19.86 v58.16,19.86 v58.15,19.87
  Top 0.406: CELLUNIT5:F1.2 CELLUNIT5:R3.1
  Bottom 0.254: CELLUNIT5:D2.C 66.62,28.12 v67.64,29.13
  Bottom 0.406: R7.1 51.42,76.43 51.42,66.48 49.99,65.04 49.99,61.01 51.64,59.36 55.57,59.36 58.11,56.82 58.11,28.75 56.97,27.61 56.97,20.86 57.16,20.86 v58.15,19.87
AFTFUSE1  (via drill 0.6)
  Top 0.254: R9.1 17.78,73.18 | 17.78,73.18 17.63,73.18 16.64,72.19 16.64,70.69 CELLUNIT15:R3.1 | v16.38,74.35 16.62,74.35 17.78,73.18
  Top 0.305: R9.1 R10.1 19.18,76.63 19.94,77.39 23.24,77.39 25.74,74.89 v25.74,71.93
  Top 0.406: CELLUNIT15:F1.2 CELLUNIT15:R3.1
  Bottom 0.254: CELLUNIT15:D2.C 15.37,69.39 14.86,69.9 14.86,72.82 v16.38,74.35
  Bottom 0.406: 28.28,21.08 R15.1 29.06,21.85 29.06,31.83 29.57,32.33 29.57,33.73 29.26,34.04 29.26,37.01 28.12,38.15 24.38,38.15 24.13,38.41 24.13,70.31 v25.74,71.93
B1
  Top 0.254: CELLUNIT6:F1.1 67.64,75.66 67.64,77.01 60.91,83.74 60.91,86.79 59.88,87.83 U$3.2
B2
  Top 0.254: U$3.3 62.07,83.47 68.4,77.14 68.4,71.21 CELLUNIT7:F1.1
B3
  Top 0.254: U$3.4 63.07,86.98 63.07,83.24 68.91,77.39 68.91,66.34 67.64,65.08 CELLUNIT8:F1.1
B4
  Top 0.254: U$3.5 64.28,82.92 69.55,77.65 69.55,61.56 CELLUNIT9:F1.1
B5
  Top 0.254: U$3.6 65.23,87.02 65.23,82.73 70.18,77.77 70.18,56.31 67.89,54.03 CELLUNIT10:F1.1
B6
  Top 0.254: U$3.7 66.48,82.24 70.81,77.9 70.81,51.78 CELLUNIT1:F1.1
B7
  Top 0.254: U$3.8 67.51,86.94 67.51,82.22 71.45,78.28 71.45,45.52 69.04,43.1 CELLUNIT2:F1.1
B8
  Top 0.254: U$3.9 68.68,81.82 71.96,78.54 71.96,39.8 70.05,37.9 67.73,37.9 CELLUNIT3:F1.1
B9
  Top 0.254: U$3.10 69.8,86.85 69.8,81.71 72.59,78.92 72.59,34.34 70.56,32.31 CELLUNIT4:F1.1
B10
  Top 0.254: U$3.11 70.88,81.4 73.1,79.17 73.1,31.42 68.53,26.85 CELLUNIT5:F1.1
B11
  Top 0.254: CELLUNIT16:F1.1 9.14,21.64 6.22,24.56 6.22,76.08 U$7.2
B12
  Top 0.254: CELLUNIT17:F1.1 10.92,27.1 6.86,31.17 6.86,74.85 15.82,83.82 19.16,83.82 U$7.3
B13
  Top 0.254: CELLUNIT18:F1.1 10.03,32.44 7.49,34.98 7.49,74.6 16.23,83.34 20.62,83.34 21.34,84.05 21.34,86.86 U$7.4
B14
  Top 0.254: CELLUNIT19:F1.1 11.18,37.9 8.13,40.95 8.13,74.35 16.64,82.85 20.98,82.85 22.45,84.33 22.45,84.91 U$7.5
B15
  Top 0.254: CELLUNIT20:F1.1 10.67,43.48 8.76,45.39 8.76,74.22 15.24,80.7 16.89,80.7 18.49,82.3 21.95,82.3 23.6,83.95 23.6,86.8 U$7.6
B16
  Top 0.254: CELLUNIT11:F1.1 11.3,48.95 9.4,50.85 9.4,73.84 15.75,80.19 17.91,80.19 19.48,81.76 23.09,81.76 24.66,83.34 U$7.7
B17
  Top 0.254: CELLUNIT12:F1.1 11.3,54.41 10.03,55.68 10.03,73.71 16,79.68 18.92,79.68 20.4,81.15 23.9,81.15 25.81,83.06 25.81,86.79 U$7.8
B18
  Top 0.254: CELLUNIT13:F1.1 10.54,61.3 10.54,73.33 16.38,79.17 20.07,79.17 21.51,80.62 24.26,80.62 26.87,83.24 26.87,84.92 U$7.9
B19
  Top 0.254: CELLUNIT14:F1.1 12.1,65.29 11.05,66.34 11.05,73.08 16.51,78.54 20.83,78.54 22.3,80.01 27.05,80.01 27.99,80.95 27.99,86.8 U$7.10
B20
  Top 0.254: CELLUNIT15:F1.1 12.07,70.7 12.07,73.46 16.64,78.03 21.46,78.03 22.92,79.48 28.28,79.48 29.08,80.29 29.08,84.91 U$7.11
C0
  Top 0.254: R8.1 35.29,76.92 | 35.29,76.92 C4.1 | 35.29,76.92 39.1,76.92 39.39,76.63 39.39,75.79 39.75,75.44 41.63,75.44 42.24,74.83 43.54,74.83 43.92,74.45 43.92,74.12 44.12,73.91 45.02,73.91 U$1.26
C0A
  Top 0.254: R16.1 40.58,19.78 C10.1 40.53,19.96 36.4,19.96 35.81,20.55 35.81,23.37 35.56,23.62 U$5.26
C1
  Top 0.254: U$1.24 52.7,74.47 58.85,74.47 CELLUNIT6:R3.2
  Top 0.406: CELLUNIT6:R3.2 60.27,76.38 CELLUNIT6:C1.1
C1A
  Top 0.254: U$5.24 27.01,23.04 20.85,23.04 CELLUNIT16:R3.2
  Top 0.406: CELLUNIT16:R3.2 19.43,21.13 CELLUNIT16:C1.1
C2
  Top 0.254: U$1.22 54.12,73.39 56.97,70.41 CELLUNIT7:R3.2
  Top 0.406: CELLUNIT7:R3.2 60.27,70.41 CELLUNIT7:C1.1
C2A
  Top 0.254: U$5.22 25.58,24.13 22.73,27.1 CELLUNIT17:R3.2
  Top 0.406: CELLUNIT17:R3.2 19.43,27.1 CELLUNIT17:C1.1
C3
  Top 0.254: CELLUNIT8:C1.1 58.24,67.61 57.86,67.87 57.86,68.5 54.18,72.31 52.68,72.31 U$1.20
  Top 0.406: CELLUNIT8:R3.2 60.27,65.08 CELLUNIT8:C1.1
C3A
  Top 0.254: CELLUNIT18:C1.1 21.46,29.9 21.84,29.64 21.84,29.01 25.53,25.2 27.02,25.2 U$5.20
  Top 0.406: CELLUNIT18:R3.2 19.43,32.44 CELLUNIT18:C1.1
C4
  Top 0.254: U$1.18 54.09,71.38 57.23,68.25 57.23,63.8 59.13,62.15 CELLUNIT9:C1.1
  Top 0.406: CELLUNIT9:R3.2 60.27,59.61 CELLUNIT9:C1.1
C4A
  Top 0.254: U$5.18 25.61,26.13 22.48,29.26 22.48,33.71 20.57,35.36 CELLUNIT19:C1.1
  Top 0.406: CELLUNIT19:R3.2 19.43,37.9 CELLUNIT19:C1.1
C5
  Top 0.254: U$1.16 54.33,70.38 56.59,68.12 56.59,59.61 58.5,57.71 58.5,57.33 59.26,56.57 CELLUNIT10:C1.1
  Top 0.406: CELLUNIT10:R3.2 60.27,54.03 CELLUNIT10:C1.1
C5A
  Top 0.254: U$5.16 25.38,27.13 23.11,29.39 23.11,37.9 21.21,39.8 21.21,40.18 20.45,40.95 CELLUNIT20:C1.1
  Top 0.406: CELLUNIT20:R3.2 19.43,43.48 CELLUNIT20:C1.1
C6
  Top 0.254: CELLUNIT1:C1.1 58.62,51.1 57.86,51.87 57.86,57.45 55.96,59.36 55.96,68 54.56,69.39 52.62,69.39 U$1.14
  Top 0.406: CELLUNIT1:R3.2 60.27,48.56 CELLUNIT1:C1.1
C6A
  Top 0.254: CELLUNIT11:C1.1 21.08,46.41 21.84,45.64 21.84,40.06 23.75,38.15 23.75,29.51 25.15,28.12 27.08,28.12 U$5.14
  Top 0.406: CELLUNIT11:R3.2 19.43,48.95 CELLUNIT11:C1.1
C7
  Top 0.254: U$1.12 54.17,68.38 55.32,67.23 55.32,59.11 57.35,57.07 57.35,51.74 58.5,50.6 58.5,43.87 59.26,43.1 CELLUNIT2:R3.2
  Top 0.406: CELLUNIT2:R3.2 60.27,43.1 CELLUNIT2:C1.1
C7A
  Top 0.254: U$5.12 25.53,29.13 24.38,30.28 24.38,38.41 22.35,40.44 22.35,53.64 21.59,54.41 CELLUNIT12:R3.2
  Top 0.406: CELLUNIT12:R3.2 19.43,54.41 CELLUNIT12:C1.1
C8
  Top 0.254: U$1.10 52.63,67.36 54.56,67.36 54.81,67.11 54.81,58.85 56.84,56.82 56.84,51.61 58.11,50.34 58.11,42.47 CELLUNIT3:C1.1
  Top 0.406: CELLUNIT3:R3.2 60.27,37.77 CELLUNIT3:C1.1
C8A
  Top 0.254: CELLUNIT13:C1.1 22.23,57.2 22.86,56.57 22.86,40.69 24.89,38.66 24.89,30.4 25.15,30.15 27.07,30.15 U$5.10
  Top 0.406: CELLUNIT13:R3.2 19.43,59.74 CELLUNIT13:C1.1
C9
  Top 0.254: U$1.8 52.65,66.34 53.92,66.34 54.3,65.96 54.3,58.6 56.34,56.57 56.34,51.36 57.61,50.09 57.61,36.5 59.26,34.85 CELLUNIT4:C1.1
  Top 0.406: CELLUNIT4:R3.2 60.27,32.31 CELLUNIT4:C1.1
C9A
  Top 0.254: CELLUNIT14:C1.1 22.61,62.66 23.37,61.9 23.37,40.95 25.4,38.91 25.4,31.55 25.78,31.17 27.06,31.17 U$5.8
  Top 0.406: CELLUNIT14:R3.2 19.43,65.2 CELLUNIT14:C1.1
C10  (via drill 0.6)
  Top 0.254: U$1.6 53.8,65.38 53.9,65.28 53.9,64.52 53.76,64.38 U$1.4 v51.04,64.38 | v58.34,26.98 60.25,26.98 CELLUNIT5:R3.2
  Top 0.406: CELLUNIT5:R3.2 60.27,26.85 CELLUNIT5:C1.1
  Bottom 0.254: v51.04,64.38 51.04,61.27 51.93,60.38 55.57,60.38 58.75,57.2 58.75,27.39 v58.34,26.98
C10A  (via drill 0.6)
  Top 0.254: U$5.6 25.9,32.13 25.81,32.23 25.81,32.99 25.95,33.13 U$5.4 v28.66,33.13 | v21.74,70.53 19.46,70.53 CELLUNIT15:R3.2
  Top 0.406: CELLUNIT15:R3.2 19.43,70.66 CELLUNIT15:C1.1
  Bottom 0.254: v21.74,70.53 22.44,70.53 23.14,69.83 23.14,38 24,37.14 27.77,37.14 28.66,36.24 v28.66,33.13
CELL0V
  Top 0.254: U$3.1 59.88,81.22 F0.1
CELL0V1A
  Top 0.254: F1.1 13.34,16.56 5.59,24.31 5.59,78.97 16.38,89.76 18.39,89.76 19.2,88.95 19.2,86.06 U$7.1
CI1  (via drill 0.6)
  Top 0.254: v13.08,45.39 13.08,46.03 13.59,46.53 16.51,46.53 CELLUNIT11:C1.2 | 16.6,43.45 16.61,43.46 CELLUNIT20:R3.1 CELLUNIT20:F1.2
  Top 0.406: 16.6,43.45 CELLUNIT11:C1.2
  Bottom 0.254: CELLUNIT11:D2.A 19.61,45.57 19.3,45.26 16.38,45.26 15.75,44.63 | 15.75,44.63 15.75,42.29 CELLUNIT20:D2.C | 15.75,44.63 13.84,44.63 v13.08,45.39
CI5  (via drill 0.6)
  Top 0.254: v66.62,52.12 66.62,51.49 66.12,50.98 63.2,50.98 CELLUNIT1:C1.2 | 63.11,54.06 63.09,54.05 CELLUNIT10:R3.1 CELLUNIT10:F1.2
  Top 0.406: 63.11,54.06 CELLUNIT1:C1.2
  Bottom 0.254: CELLUNIT1:D2.A 60.1,51.94 60.4,52.25 63.32,52.25 63.96,52.88 | 63.96,52.88 63.96,55.22 CELLUNIT10:D2.C | 63.96,52.88 65.86,52.88 v66.62,52.12
CONINM
  Top 0.254: 46.29,53.18 45.29,53.18 TP12.TP | JP3.1 60.53,16.96 U$6.P$2
  Top 0.305: 46.29,53.18 46.47,53.18 50.37,49.28 50.37,17.6 51.97,16 56.52,16 JP3.1
CONINM1
  Top 0.254: U$2.8 42.26,53.18 | TP11.TP U$2.8 | U$2.8
CONINP
  Top 0.254: 55.82,13.59 51.8,13.59 48.89,16.5 48.89,49.05 47.28,50.67 45.67,50.67 TP10.TP | JP4.1 60.28,13.59 U$6.P$1
  Top 0.305: 55.82,13.59 JP4.1
CONINP1
  Top 0.254: 42.29,50.67 U$2.6 TP9.TP
GND  (via drill 0.6)
  Top 0.254: 49.9,79.91 C3.2 49.43,79.98 48.64,79.98 48.06,79.4 | CELLUNIT6:C1.2 63.07,79.42 62.43,80.06 57.73,80.06 | 57.73,80.06 54.2,80.06 54.05,79.91 | v57.73,78.16 57.73,80.06 | 57.73,80.06 57.73,80.78 F0.2 57.88,80.97 | U$1.31 U$1.30 47.37,71.88 47.93,72.44 v47.93,75.62 47.93,79.27 48.06,79.4 | R8.2 C2.2 47.73,79.73 48.06,79.4 | R8.2 | R8.2 38.14,80.63 37.39,81.38 33.2,81.38 32.46,80.64 C4.2 C1.2 R6.1 | C5.1 54.25,79.93 54.25,82.07 52.45,83.87 51.56,83.87 U$8.P6
  Top 0.406: C5.1 54.05,79.91 49.55,79.91 C3.2
  Bottom 0.254: CELLUNIT6:D2.A 58.62,77.27 v57.73,78.16 | C6.1 46.73,76.81 v47.93,75.62
GND1  (via drill 0.6)
  Top 0.254: 29.81,17.6 C9.2 | CELLUNIT16:C1.2 16.63,18.09 17.27,17.45 21.97,17.45 | 21.97,17.45 25.51,17.45 25.65,17.6 | v21.97,19.36 21.97,17.45 | 21.97,17.45 21.97,16.73 F1.2 21.84,16.52 21.84,15.82 21.67,15.65 12.85,15.65 4.55,23.95 4.55,78.97 16.36,90.78 48.64,90.78 51.56,87.86 51.56,86.37 U$8.P12 | 43.43,19.23 43.47,19.26 C7.2 43.47,23.6 45.24,25.38 45.24,31.86 R14.1 | 43.43,19.23 43.43,19.83 C10.2 43.45,16.89 R16.2 | U$5.31 U$5.30 34.64,25.6 33.55,25.6 33.17,25.22 33.17,22.68 v33.83,22.02 34.7,21.16 34.7,18.16 | C8.2 34.09,17.56 34.7,18.16 | 43.43,19.23 43.43,16.99 43.28,16.84 43.28,15.88 42.75,15.34 37.52,15.34 34.7,18.16
  Top 0.406: 32.6,17.49 C8.2 | 32.67,17.56 C8.2 | C11.1 25.65,17.6 30.16,17.6 C9.2 C8.2
  Bottom 0.254: CELLUNIT16:D2.A 21.08,20.24 v21.97,19.36 | C12.1 32.97,21.16 v33.83,22.02
IMA
  Top 0.254: U$1.41 46.39,66.38 47.95,64.82 47.95,57.84 47.04,56.93 40.13,56.93 R4.1 TP15.TP
IMA1
  Top 0.254: U$2.1 43.56,44.27 TP7.TP
IMA1O
  Top 0.254: 44.41,41.2 R12.1 | R12.1 44.21,40.02 44.02,39.83 41.66,39.83 40.54,40.95 33.78,40.95 32.26,39.42 32.26,32.39 33.53,31.11 34.65,31.11 U$5.41 | TP8.TP 44.21,42.52 R12.1
IMAT
  Top 0.254: U$2.9 33.51,53.18 32.79,53.18 32.03,53.94 32.03,56.33 32.5,56.8 33.78,56.8 TP16.TP
IMB
  Top 0.254: U$2.16 31.98,44.27 29.97,46.28 29.97,61.72 33.17,64.92 34.9,64.92 TP2.TP
IMB1O
  Top 0.254: U$5.47 34.71,34.09 37.59,34.09 38.79,35.28 R11.1 39.93,35.89 41.99,37.95 45.62,37.95 46.71,36.86 46.71,15.7 43.86,12.85 JP1.1 12.86,12.84 5.83,19.87 4.02,19.87 3.35,19.2 3.35,17.75 U$4.P$1
IMBO
  Top 0.254: U$1.47 41.12,63.38 39.55,64.95 39,64.95 R3.1 35.99,64.96 TP1.TP
IPA
  Top 0.254: U$1.42 46.01,65.88 46.81,65.08 46.81,60.5 45.95,59.64 40.01,59.64 R4.2 | 39.91,59.74 R4.2 | R4.2 39.87,59.78 35.28,59.78 TP13.TP
IPA1
  Top 0.254: U$2.3 45.95,46.81 47.12,45.64 47.12,44.14 TP5.TP
IPA1O
  Top 0.254: R12.2 | R12.2 47.05,39.66 46.61,39.22 41.07,39.22 40.21,40.08 34.04,40.08 32.94,38.99 32.94,32.46 33.76,31.65 34.64,31.65 U$5.42 | TP6.TP 47.05,43.1 R12.2
IPAT
  Top 0.254: U$2.11 33.51,50.61 32.09,50.61 31.27,51.42 31.27,59.08 31.97,59.78 34.19,59.78 TP14.TP
IPB
  Top 0.254: U$2.14 33.42,46.91 31.75,46.91 30.61,48.06 30.61,60.81 31.91,62.11 34.09,62.11 TP4.TP
IPB1O
  Top 0.254: U$5.48 36.36,34.63 36.8,35.08 36.8,37.64 37.87,38.71 38.77,38.71 R11.2 46.21,38.72 47.45,37.49 47.45,11.05 45.02,8.62 JP2.1 19.32,8.64 13.12,8.64 5.79,15.96 5.79,17.7 U$4.P$2
IPBO
  Top 0.254: U$1.48 40.78,62.88 40,62.1 R3.2 35.1,62.11 TP3.TP
N$1  (via drill 0.6)
  Top 0.254: v49.53,81.76 38.05,81.76 37.57,82.24 32.54,82.24 v31.62,81.33
  Bottom 0.254: R7.2 52.06,79.92 C6.2 48.98,79.92 49.63,80.57 49.63,81.66 v49.53,81.76 | v31.62,81.33 31.62,73.92 T1.2
  Bottom 0.406: T1.4 T1.2
N$3  (via drill 0.6)
  Top 0.254: v66.12,46.91 66.12,46.15 65.61,45.64 CELLUNIT2:C1.2
  Top 0.406: CELLUNIT1:F1.2 CELLUNIT1:R3.1 63.09,45.64 CELLUNIT2:C1.2
  Bottom 0.254: CELLUNIT2:D2.A 60.1,46.74 60.4,47.04 63.07,47.04 63.7,47.68 | 63.7,47.68 63.7,49.88 CELLUNIT1:D2.C | 63.7,47.68 65.35,47.68 v66.12,46.91
N$6  (via drill 4 pad 6)
  other vias: 9.86,90.35
N$11
  Top 0.254: U$1.1 50.35,62.88 50.01,63.22 50.01,65.72 50.51,66.22 50.51,74.48 54.29,77.11 C5.2 | 55.23,55.95 55.23,50.81 56.59,49.45 56.59,23.55 58.88,21.26 60.13,21.26 R2.2
  Top 0.305: U$1.1 52.61,58.57 55.23,55.95
N$12  (via drill 0.6)
  Top 0.254: U$1.38 38.27,67.88 v38.18,67.79
  Bottom 0.254: T1.1 29.67,71.96 28.96,71.25 28.96,66.29 29.97,65.28 33.93,65.28 34.8,66.14 34.8,67.06 35.53,67.79 v38.18,67.79 | T1.1
N$13  (via drill 4 pad 6)
  other vias: 67.6,6.99
N$15
  Top 0.254: R9.2 23.39,73.18 23.88,72.69 23.88,41.33 25.93,39.27 25.93,34.57 26.39,34.11 27.07,34.11 U$5.2
N$16
  Top 0.254: C1.1 35.97,74.26 36.7,73.53 36.7,71.17 38,69.88 U$1.34
N$17  (via drill 0.6)
  Top 0.254: U$1.35 46.9,69.38 v47.32,69.8 | v46,75.44 42.36,75.44 C2.1
  Bottom 0.254: v46,75.44 46,71.12 v47.32,69.8
N$19
  Top 0.254: R6.2 35.19,69.24 R5.1 35.2,66.65 35.69,66.17 40.28,66.17 40.56,65.89 40.56,64.97 41.66,63.88 U$1.46
N$20
  Top 0.254: U$5.1 29.36,34.63 29.7,34.29 29.7,31.79 29.2,31.29 29.2,23.03 25.42,20.4 C11.2
  Top 0.305: U$5.1 27.09,38.94 24.47,41.56 24.47,74.89 23.72,75.65 R10.2
N$21
  Top 0.254: R1.2 60.2,23.93 58.75,23.93 57.1,25.58 57.1,49.71 55.83,50.98 55.83,56.19 53.77,58.24 53.77,62.94 53.33,63.38 U$1.2
N$22
  Top 0.254: U$1.45 42.1,64.38 41.17,65.3 41.17,66.4 40.64,66.93 37.29,66.93 36.88,67.34 36.88,70.1 36.09,70.89 35.74,70.89 35.23,71.4 35.23,72.07 R5.2
N$23
  Top 0.254: U$5.34 39.91,27.63 40.72,26.82 40.72,22.38 C7.1
N$25
  Top 0.254: U$5.35 32.98,28.13 32.7,27.85 32.7,20.4 C8.1
N$36
  Top 0.254: R14.2 41.9,35.33 R13.1 40.91,35.32 39.22,33.63 U$5.46
N$49
  Top 0.254: R13.2 39.79,32.48 39.14,33.12 U$5.45
N$63
  Bottom 0.254: T2.2 46.89,15.82 45.64,14.58 35.98,14.58 C12.2 27.64,17.59 R15.2
  Bottom 0.406: T2.2 T2.4
N$64  (via drill 0.6)
  Top 0.254: v66.12,41.33 65.23,40.31 CELLUNIT3:C1.2
  Top 0.406: CELLUNIT2:F1.2 CELLUNIT2:R3.1 63.09,40.31 CELLUNIT3:C1.2
  Bottom 0.254: CELLUNIT3:D2.A 60.1,41.02 60.65,41.58 63.07,41.58 63.7,42.22 | 63.7,42.22 63.7,44.42 CELLUNIT2:D2.C | 63.7,42.22 65.61,42.22 v66.12,41.33
N$65  (via drill 0.6)
  Top 0.254: 63.07,32.29 CELLUNIT4:R3.1 | v65.99,30.66 65.99,29.77 65.61,29.39 CELLUNIT5:C1.2
  Top 0.406: CELLUNIT4:F1.2 CELLUNIT4:R3.1 | CELLUNIT5:C1.2 63.07,32.29
  Bottom 0.254: CELLUNIT5:D2.A 60.1,30.23 60.78,30.91 63.32,30.91 63.58,31.17 | 63.58,31.17 63.58,33.63 CELLUNIT4:D2.C | 63.58,31.17 65.48,31.17 v65.99,30.66
N$66  (via drill 0.6)
  Top 0.254: v65.99,36.25 65.99,35.48 65.35,34.85 CELLUNIT4:C1.2
  Top 0.406: CELLUNIT3:F1.2 CELLUNIT3:R3.1 63.09,34.85 CELLUNIT4:C1.2
  Bottom 0.254: CELLUNIT4:D2.A 60.1,35.82 60.53,36.25 63.2,36.25 63.58,36.63 | 63.58,36.63 63.58,39.09 CELLUNIT3:D2.C | 63.58,36.63 65.61,36.63 v65.99,36.25
N$68  (via drill 0.6)
  Top 0.254: U$5.38 43.07,29.63 v43.64,29.06
  Bottom 0.254: v43.64,29.06 48.39,29.06 49.71,27.74 49.71,19.02 T2.1
N$70  (via drill 0.6)
  Top 0.254: v66.37,72.31 63.71,72.31 CELLUNIT7:C1.2
  Top 0.406: CELLUNIT6:F1.2 CELLUNIT6:R3.1 63.09,72.95 CELLUNIT7:C1.2
  Bottom 0.254: CELLUNIT7:D2.A 60.1,74.04 60.4,74.35 63.32,74.35 63.7,74.73 | 63.7,74.73 63.7,77.06 CELLUNIT6:D2.C | 63.7,74.73 65.73,74.73 66.62,73.84 66.62,72.57 v66.37,72.31
N$71  (via drill 0.6)
  Top 0.254: v66.37,68.88 66.37,67.87 66.12,67.61 CELLUNIT8:C1.2
  Top 0.406: CELLUNIT7:F1.2 CELLUNIT7:R3.1 63.09,67.61 CELLUNIT8:C1.2
  Bottom 0.254: CELLUNIT8:D2.A 60.1,68.58 60.53,69.01 63.45,69.01 63.83,69.39 | 63.83,69.39 63.83,71.47 CELLUNIT7:D2.C | 63.83,69.39 65.86,69.39 v66.37,68.88
N$72  (via drill 0.6)
  Top 0.254: v66.5,57.84 66.5,56.95 66.12,56.57 CELLUNIT10:C1.2
  Top 0.406: CELLUNIT9:F1.2 CELLUNIT9:R3.1 63.07,59.59 CELLUNIT10:C1.2
  Bottom 0.254: CELLUNIT10:D2.A 60.1,57.79 60.4,58.09 63.2,58.09 63.7,58.6 | 63.7,58.6 63.7,60.93 CELLUNIT9:D2.C | 63.7,58.6 65.73,58.6 v66.5,57.84
N$73  (via drill 0.6)
  Top 0.254: v66.37,63.3 66.37,62.53 65.99,62.15 CELLUNIT9:C1.2
  Top 0.406: CELLUNIT8:F1.2 CELLUNIT8:R3.1 63.09,62.15 CELLUNIT9:C1.2
  Bottom 0.254: CELLUNIT9:D2.A 60.1,63.25 60.53,63.68 63.45,63.68 63.83,64.06 | 63.83,64.06 63.83,66.14 CELLUNIT8:D2.C | 63.83,64.06 65.86,64.06 v66.37,63.3
N$76  (via drill 0.6)
  Top 0.254: v13.59,50.6 13.59,51.36 14.1,51.87 CELLUNIT12:C1.2
  Top 0.406: CELLUNIT11:F1.2 CELLUNIT11:R3.1 16.61,51.87 CELLUNIT12:C1.2
  Bottom 0.254: CELLUNIT12:D2.A 19.61,50.77 19.3,50.47 16.64,50.47 16,49.83 | 16,49.83 16,47.63 CELLUNIT11:D2.C | 16,49.83 14.35,49.83 v13.59,50.6
N$77  (via drill 0.6)
  Top 0.254: v13.59,56.19 14.48,57.2 CELLUNIT13:C1.2
  Top 0.406: CELLUNIT12:F1.2 CELLUNIT12:R3.1 16.61,57.2 CELLUNIT13:C1.2
  Bottom 0.254: CELLUNIT13:D2.A 19.61,56.49 19.05,55.93 16.64,55.93 16,55.3 | 16,55.3 16,53.09 CELLUNIT12:D2.C | 16,55.3 14.1,55.3 v13.59,56.19
N$78  (via drill 0.6)
  Top 0.254: 16.63,65.22 CELLUNIT14:R3.1 | v13.72,66.85 13.72,67.74 14.1,68.12 CELLUNIT15:C1.2
  Top 0.406: CELLUNIT14:F1.2 CELLUNIT14:R3.1 | CELLUNIT15:C1.2 16.63,65.22
  Bottom 0.254: CELLUNIT15:D2.A 19.61,67.28 18.92,66.6 16.38,66.6 16.13,66.34 | 16.13,66.34 16.13,63.88 CELLUNIT14:D2.C | 16.13,66.34 14.22,66.34 v13.72,66.85
N$79  (via drill 0.6)
  Top 0.254: v13.72,61.27 13.72,62.03 14.35,62.66 CELLUNIT14:C1.2
  Top 0.406: CELLUNIT13:F1.2 CELLUNIT13:R3.1 16.61,62.66 CELLUNIT14:C1.2
  Bottom 0.254: CELLUNIT14:D2.A 19.61,61.69 19.18,61.27 16.51,61.27 16.13,60.88 | 16.13,60.88 16.13,58.42 CELLUNIT13:D2.C | 16.13,60.88 14.1,60.88 v13.72,61.27
N$81  (via drill 0.6)
  Top 0.254: v13.34,25.2 16,25.2 CELLUNIT17:C1.2
  Top 0.406: CELLUNIT16:F1.2 CELLUNIT16:R3.1 16.61,24.56 CELLUNIT17:C1.2
  Bottom 0.254: CELLUNIT17:D2.A 19.61,23.47 19.3,23.17 16.38,23.17 16,22.78 | 16,22.78 16,20.45 CELLUNIT16:D2.C | 16,22.78 13.97,22.78 13.08,23.67 13.08,24.94 v13.34,25.2
N$82  (via drill 0.6)
  Top 0.254: v13.34,28.63 13.34,29.64 13.59,29.9 CELLUNIT18:C1.2
  Top 0.406: CELLUNIT17:F1.2 CELLUNIT17:R3.1 16.61,29.9 CELLUNIT18:C1.2
  Bottom 0.254: CELLUNIT18:D2.A 19.61,28.93 19.18,28.5 16.26,28.5 15.88,28.12 | 15.88,28.12 15.88,26.04 CELLUNIT17:D2.C | 15.88,28.12 13.84,28.12 v13.34,28.63
N$83  (via drill 0.6)
  Top 0.254: v13.21,39.67 13.21,40.56 13.59,40.95 CELLUNIT20:C1.2
  Top 0.406: CELLUNIT19:F1.2 CELLUNIT19:R3.1 16.63,37.92 CELLUNIT20:C1.2
  Bottom 0.254: CELLUNIT20:D2.A 19.61,39.72 19.3,39.42 16.51,39.42 16,38.91 | 16,38.91 16,36.58 CELLUNIT19:D2.C | 16,38.91 13.97,38.91 v13.21,39.67
N$84  (via drill 0.6)
  Top 0.254: v13.34,34.21 13.34,34.98 13.72,35.36 CELLUNIT19:C1.2
  Top 0.406: CELLUNIT18:F1.2 CELLUNIT18:R3.1 16.61,35.36 CELLUNIT19:C1.2
  Bottom 0.254: CELLUNIT19:D2.A 19.61,34.26 19.18,33.83 16.26,33.83 15.88,33.45 | 15.88,33.45 15.88,31.37 CELLUNIT18:D2.C | 15.88,33.45 13.84,33.45 v13.34,34.21
T1  (via drill 0.6)
  Top 0.254: U$1.27 43.2,73.39 v43.15,73.43
  Bottom 0.254: R30.1 47.88,67.67 43.15,72.39 v43.15,73.43 43.15,79.7 44.7,81.25 47.27,81.25 49.04,83.02 U$8.P5
T2  (via drill 0.6)
  Top 0.254: U$1.28 43.85,72.89 43.33,72.36 42.67,72.36 42.01,73.02 41.27,73.02 v41.22,73.08
  Bottom 0.254: R31.1 45.14,68.48 41.88,71.73 41.86,71.73 41.22,72.36 v41.22,73.08 42.21,74.07 42.21,79.88 43.31,80.97 43.76,80.97 46.54,83.75 U$8.P4
T3  (via drill 0.6)
  Top 0.254: U$1.29 44.04,72.39 43.51,71.86 41.17,71.86 40.08,72.95 v39.52,72.95
  Bottom 0.254: R32.1 42.6,70.08 41.38,71.3 40.54,71.3 39.55,72.29 39.55,72.92 v39.52,72.95 39.52,80.49 40.13,81.1 42.16,81.1 44.04,82.98 U$8.P3
T4  (via drill 0.6)
  Top 0.254: U$1.32 39.68,70.88 v38.4,72.16
  Bottom 0.254: R33.1 39.67,65.86 40.66,66.85 40.66,69.9 v38.4,72.16 38.4,80.39 39.78,81.76 40.64,81.76 41.54,82.66 U$8.P2
T5  (via drill 0.6)
  Top 0.254: U$1.33 38.76,70.38 v38.43,70.71
  Bottom 0.254: R34.1 36.91,64.59 39.17,66.85 39.17,69.55 38.76,69.95 37.74,69.95 37.41,70.28 37.41,71.3 | 37.41,71.3 37.41,80.72 39.04,82.34 U$8.P1 | 37.41,71.3 38,70.71 v38.43,70.71
T11  (via drill 0.6)
  Top 0.254: U$5.27 35.97,24.13 37.16,22.94 37.16,22 v36.98,21.82 | v25.3,51.69 25.3,69.62 26.92,71.25 26.92,77.11 29.74,79.93 29.74,83.16 32.94,86.36 39.02,86.36 U$8.P7
  Bottom 0.254: v36.98,21.82 36.32,21.82 33.86,24.28 31.17,24.28 30.12,25.32 30.12,41.17 27.51,43.79 R29.1 26.29,50.7 v25.3,51.69
T12  (via drill 0.6)
  Top 0.254: U$5.28 36.36,24.63 v39.01,21.97 | v26.29,52.68 26.29,69.34 27.89,70.94 27.89,77.04 30.46,79.6 30.46,82.96 32.56,85.06 40.26,85.06 U$8.P8
  Bottom 0.254: v39.01,21.97 35.69,25.3 31.47,25.3 30.86,25.91 30.86,41.94 29.03,43.76 29.03,46.58 R28.1 28.91,51.89 28.32,52.48 26.49,52.48 v26.29,52.68
T13  (via drill 0.6)
  Top 0.254: v38.73,23.62 37.21,25.15 34.68,25.15 U$5.29
  Bottom 0.254: v38.73,23.62 36.14,26.21 34.57,26.21 33.58,27.2 33.58,47.78 32.41,48.95 32.41,54.56 32.89,55.04 R27.1 26.8,55.04 25.88,55.96 25.88,69.93 27.1,71.15 27.1,76.86 30,79.76 30,82.96 31.29,84.25 31.29,86.97 32.18,87.86 42.52,87.86 U$8.P9
T14  (via drill 0.6)
  Top 0.254: U$5.32 37.05,26.63 v38.1,25.58
  Bottom 0.254: v38.1,25.58 38.1,40.72 38.91,41.53 38.91,46.81 R26.1 38.84,49 39.09,49.25 39.09,54.53 37.31,56.31 32.74,56.31 32.21,55.78 27.05,55.78 26.34,56.49 26.34,69.27 27.64,70.56 27.64,76.45 30.61,79.43 30.61,82.68 33.07,85.14 45.34,85.14 U$8.P10
T15  (via drill 0.6)
  Top 0.254: U$5.33 38.43,27.13 v39.14,26.42 | v27.99,53.52 27.99,43.79 30.3,41.48 41.63,41.48 v42.24,40.87
  Bottom 0.254: v39.14,26.42 39.14,40.21 40.56,41.63 | 40.56,41.63 R25.1 | v27.99,53.52 27.76,53.75 26.54,53.75 25.43,54.86 25.43,70.41 26.7,71.68 26.7,72.57 26.39,72.87 26.39,76.94 29.31,79.86 29.31,83.16 30.68,84.53 30.68,87.2 32.74,89.26 46.12,89.26 U$8.P11 | v42.24,40.87 41.33,40.87 40.56,41.63

### Text on the board
tPlace: 1 | 9 | NC | 1 | 9 | NC | 3 | 5 | 7 | 3 | 5 | 7 | 7 | 12 | 1 | 6 | 0 | 2 | 4 | 6 | 8 | 10 | 0 | 2 | 4 | 6 | 8 | 10 | www.teamojas.com | v10.0 | Board No. | IM | M-SIDE | IM | IP | S-SIDE | IP | #RR | C:/Users/user pc/Downloads/TE_new_logo.bmp
bPlace: 0 | 2 | 4 | WARNING / HIGH VOLTAGE | www.teamojas.com